# EAGLE schematic schematic (EAGLE 9.5.0)

## Sheet 1 of 8: GPS
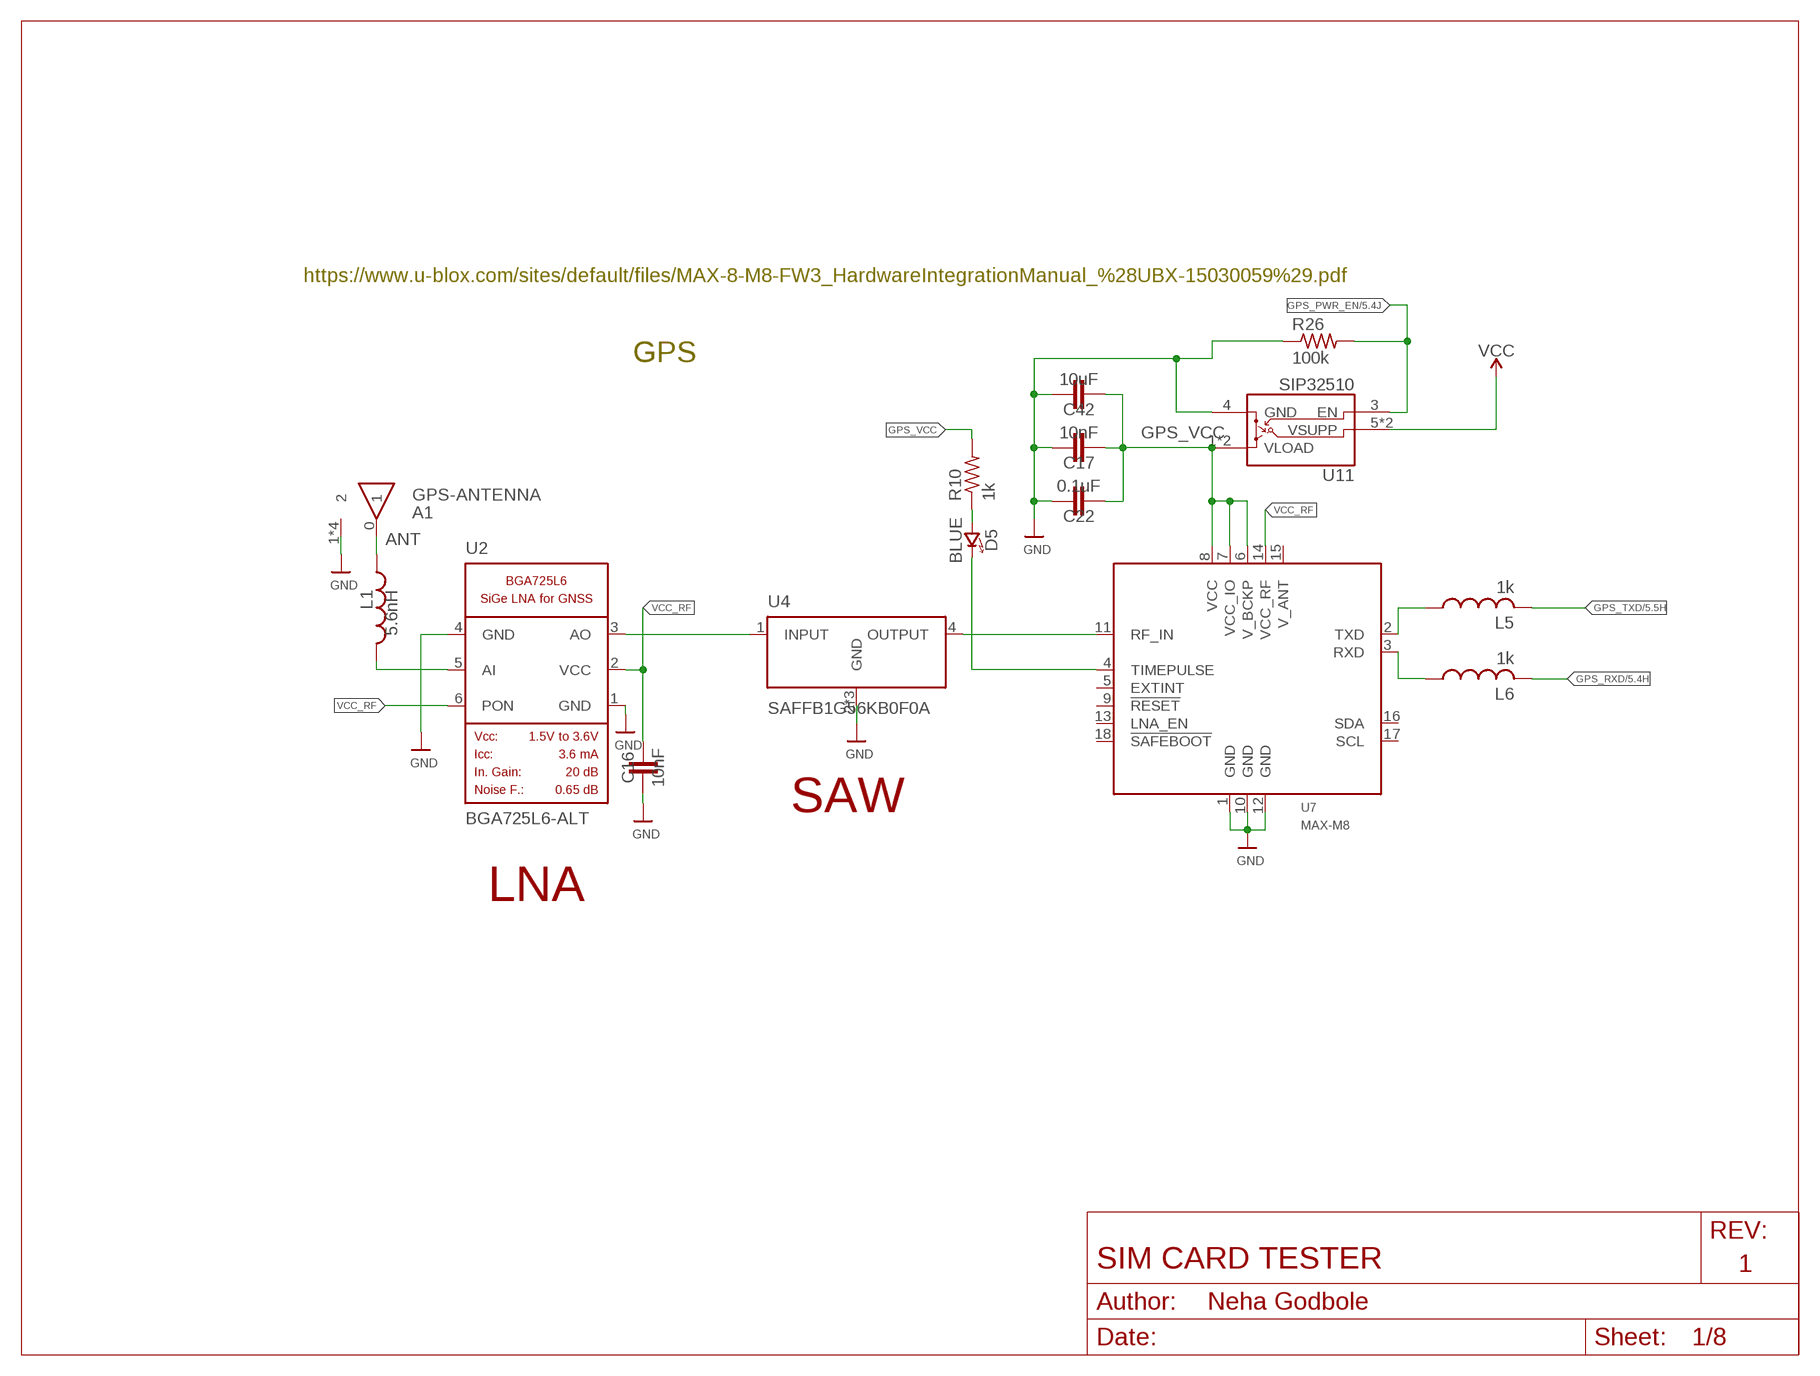
[diagram p0: schematic, sheet 1]
FRAME7 (LETTER_L_BLANK): AUTHOR: Neha Godbole; REV: 1; TITLE: SIM CARD TESTER

### Parts
A1  GPS-ANTENNA  [ANT1818B00BT1516S]
C16  10nF  CAPACITOR_0603_L  [RESC0603_L]
C17  10nF  CAPACITOR_0603_L  [RESC0603_L]
C22  0.1uF  CAPACITOR_0603_L  [RESC0603_L]
C42  10uF  CAPACITOR_0603_L  [RESC0603_L]
D5  BLUE  LED0603  [LED-0603]
L1  5.6nH  INDUCTOR_0603_M  [RESC0603_M]
L5  1k  INDUCTOR_0603_M  [RESC0603_M]
L6  1k  INDUCTOR_0603_M  [RESC0603_M]
R10  1k  R-US_R0603  [R0603]
R26  100k  R-US_R0603  [R0603]
U2  BGA725L6-ALT  [LNA-TSLP-6-2-ALT]
U4  SAFFB1G56KB0F0A  FILTERS  [QCS5I]
U7  MAX-M8  [MAX-M8]
U11  SIP32510  [TSOT23-6]

### Nets
ANT: A1.0 L1.2
GND: A1.1 A1.2 A1.3 A1.4 C16.1 C17.1 C22.1 C42.1 R26.1 U2.1(GND) U2.4(GND) U4.2(GND) U4.3(GND) U4.5(GND) U7.1(GND) U7.10(GND) U7.12(GND) U11.4(GND) ; also sheet 2,3,4,5,6,7,8
GPS_PWR_EN: R26.2 U11.3(EN) ; also sheet 5,8
GPS_RF_IN: U4.4(OUTPUT) U7.11(RF_IN)
GPS_RXD: L6.2 ; also sheet 5,8
GPS_TXD: L5.2 ; also sheet 5,8
GPS_VCC: C17.2 C22.2 C42.2 R10.2 U7.6(V_BCKP) U7.7(VCC_IO) U7.8(VCC) U11.1(VLOAD) U11.2(VLOAD)
LNA_IN: L1.1 U2.5(AI)
LNA_OUT: U2.3(AO) U4.1(INPUT)
N$1: D5.A(ANODE) R10.1
N$2: D5.C(CATHODE) U7.4(TIMEPULSE)
N$7: L5.1 U7.2(TXD)
N$8: L6.1 U7.3(RXD)
VCC: U11.5(VSUPP) U11.6(VSUPP) ; also sheet 2,3,4,5,6,7,8
VCC_RF: C16.2 U2.2(VCC) U2.6(PON) U7.14(VCC_RF)
Unconnected: U7.5(EXTINT) U7.9(!RESET) U7.13(LNA_EN) U7.15(V_ANT) U7.16(SDA) U7.17(SCL) U7.18(!SAFEBOOT)

### Notes on the sheet
- https://www.u-blox.com/sites/default/files/MAX-8-M8-FW3_HardwareIntegrationManual_%28UBX-15030059%29.pdf
- GPS
- SAW
- LNA

## Sheet 2 of 8: Hardware Watchdog & RTC
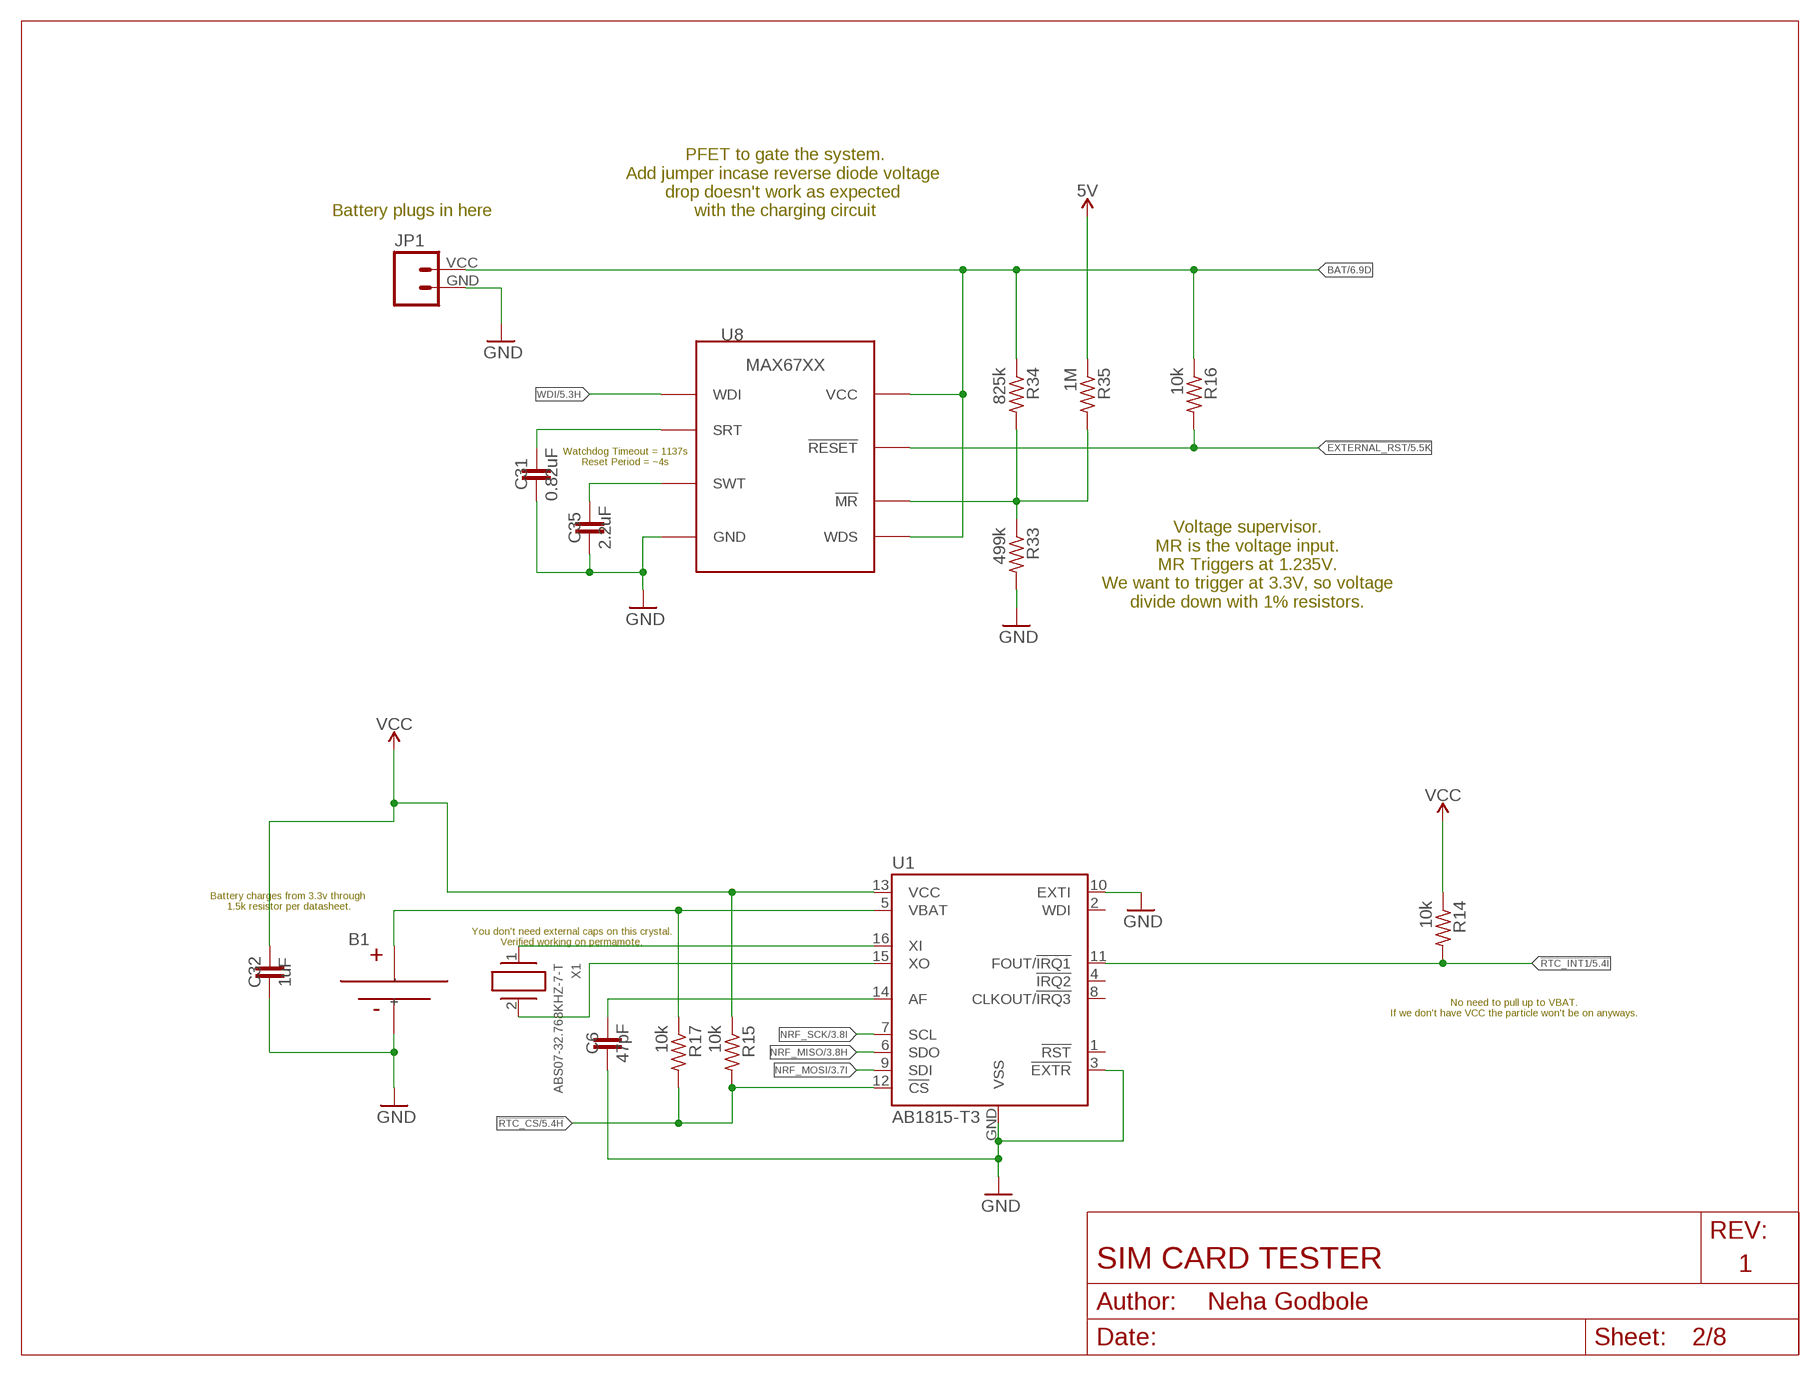
[diagram p1: schematic, sheet 2]
FRAME6 (LETTER_L_BLANK): AUTHOR: Neha Godbole; REV: 1; TITLE: SIM CARD TESTER

### Parts
B1  MS518SE  [MS518SE-FL35E]
C6  47pF  CAPACITOR_0603_L  [RESC0603_L]
C31  0.82uF  CAPACITOR_0603_L  [RESC0603_L]
C32  1uF  CAPACITOR_0603_L  [RESC0603_L]
C35  2.2uF  CAPACITOR_0603_L  [RESC0603_L]
JP1  M024UCON-15767  [JST-2-SMD-VERT]
R14  10k  R-US_R0603  [R0603]
R15  10k  R-US_R0603  [R0603]
R16  10k  R-US_R0603  [R0603]
R17  10k  R-US_R0603  [R0603]
R33  499k  R-US_R0603  [R0603]
R34  825k  R-US_R0603  [R0603]
R35  1M  R-US_R0603  [R0603]
U1  AB1815-T3  [QFN-16-3MM]
U8  MAX67XXMAX6749MAX67XX  [SOT-23-8]
X1  ABS07-32.768KHZ-7-T  [2-SMD]

### Nets
5V: R35.1 ; also sheet 4,6,8
!EXTERNAL_RST: R16.2 U8.7(!RESET) ; also sheet 5,8
!RTC_CS: R15.2 R17.2 U1.12(!CS) ; also sheet 5,8
!RTC_INT1: R14.2 U1.11(FOUT/!IRQ1) ; also sheet 5,8
BAT: JP1.VCC R16.1 R34.1 U8.5(WDS) U8.8(VCC) ; also sheet 6
GND: B1.- C6.2 C31.2 C32.2 C35.2 JP1.GND R33.2 U1.3(!EXTR) U1.10(EXTI) U1.GND(VSS) U8.4(GND) ; also sheet 1,3,4,5,6,7,8
N$5: B1.+ R17.1 U1.5(VBAT)
N$13: C6.1 U1.14(AF)
N$20: U1.15(XO) X1.2
N$21: U1.16(XI) X1.1
N$31: R33.1 R34.2 R35.2 U8.1(!MR)
N$36: C31.1 U8.3(SRT)
N$39: C35.1 U8.2(SWT)
NRF_MISO: U1.6(SDO) ; also sheet 3,5,8
NRF_MOSI: U1.9(SDI) ; also sheet 3,5,8
NRF_SCK: U1.7(SCL) ; also sheet 3
VCC: C32.1 R14.1 R15.1 U1.13(VCC) ; also sheet 1,3,4,5,6,7,8
WDI: U8.6(WDI) ; also sheet 5,8
Unconnected: U1.1(!RST) U1.2(WDI) U1.4(!IRQ2) U1.8(CLKOUT/!IRQ3)

### Notes on the sheet
- Battery plugs in here
- PFET to gate the system.
  Add jumper incase reverse diode voltage 
  drop doesn't work as expected 
  with the charging circuit
- Watchdog Timeout = 1137s
  Reset Period = ~4s
- Voltage supervisor.
  MR is the voltage input.
  MR Triggers at 1.235V.
  We want to trigger at 3.3V, so voltage
  divide down with 1% resistors.
- Battery charges from 3.3v through
   1.5k resistor per datasheet.
- You don't need external caps on this crystal.
  Verified working on permamote.
- No need to pull up to VBAT.
  If we don't have VCC the particle won't be on anyways.

## Sheet 3 of 8: SD Card Adapter
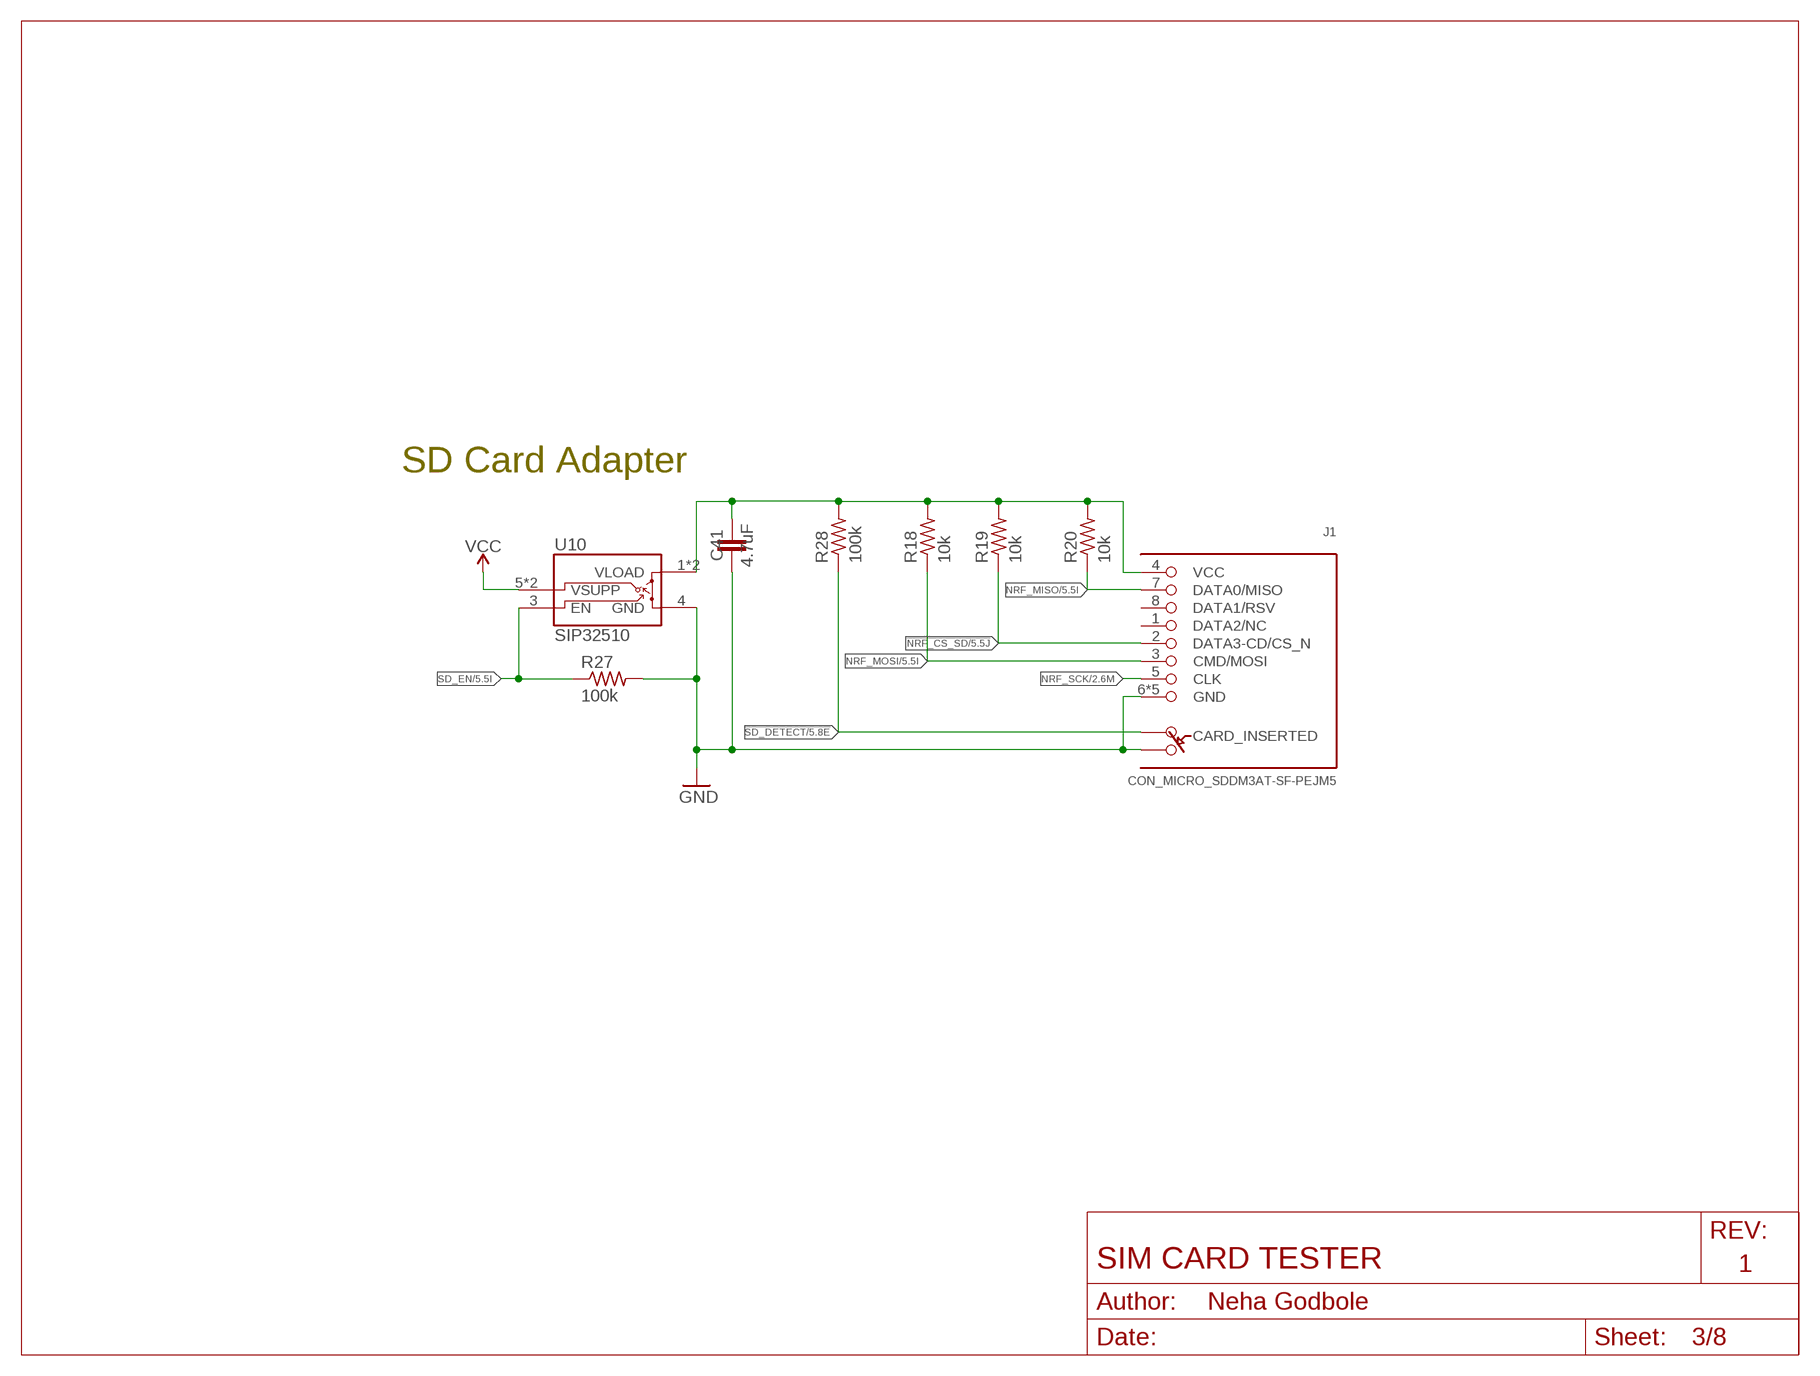
[diagram p2: schematic, sheet 3]
FRAME5 (LETTER_L_BLANK): AUTHOR: Neha Godbole; REV: 1; TITLE: SIM CARD TESTER

### Parts
C41  4.7uF  CAPACITOR_0603_L  [RESC0603_L]
J1  CON_MICRO_SDDM3AT-SF-PEJM5  [DM3AT-SF-PEJM5]
R18  10k  R-US_R0603  [R0603]
R19  10k  R-US_R0603  [R0603]
R20  10k  R-US_R0603  [R0603]
R27  100k  R-US_R0603  [R0603]
R28  100k  R-US_R0603  [R0603]
U10  SIP32510  [TSOT23-6]

### Nets
!NRF_CS_SD: J1.2(DATA3-CD/CS_N) R19.1 ; also sheet 5,8
!SD_DETECT: J1.A R28.1 ; also sheet 5,8
GND: C41.2 J1.6(GND) J1.B J1.MOUNT0(GND) J1.MOUNT1(GND) J1.MOUNT2(GND) J1.MOUNT3(GND) R27.2 U10.4(GND) ; also sheet 1,2,4,5,6,7,8
N$55: C41.1 J1.4(VCC) R18.2 R19.2 R20.2 R28.2 U10.1(VLOAD) U10.2(VLOAD)
NRF_MISO: J1.7(DATA0/MISO) R20.1 ; also sheet 2,5,8
NRF_MOSI: J1.3(CMD/MOSI) R18.1 ; also sheet 2,5,8
NRF_SCK: J1.5(CLK) ; also sheet 2
SD_EN: R27.1 U10.3(EN) ; also sheet 5,8
VCC: U10.5(VSUPP) U10.6(VSUPP) ; also sheet 1,2,4,5,6,7,8
Unconnected: J1.1(DATA2/NC) J1.8(DATA1/RSV)

### Notes on the sheet
- SD Card Adapter

## Sheet 4 of 8: USB
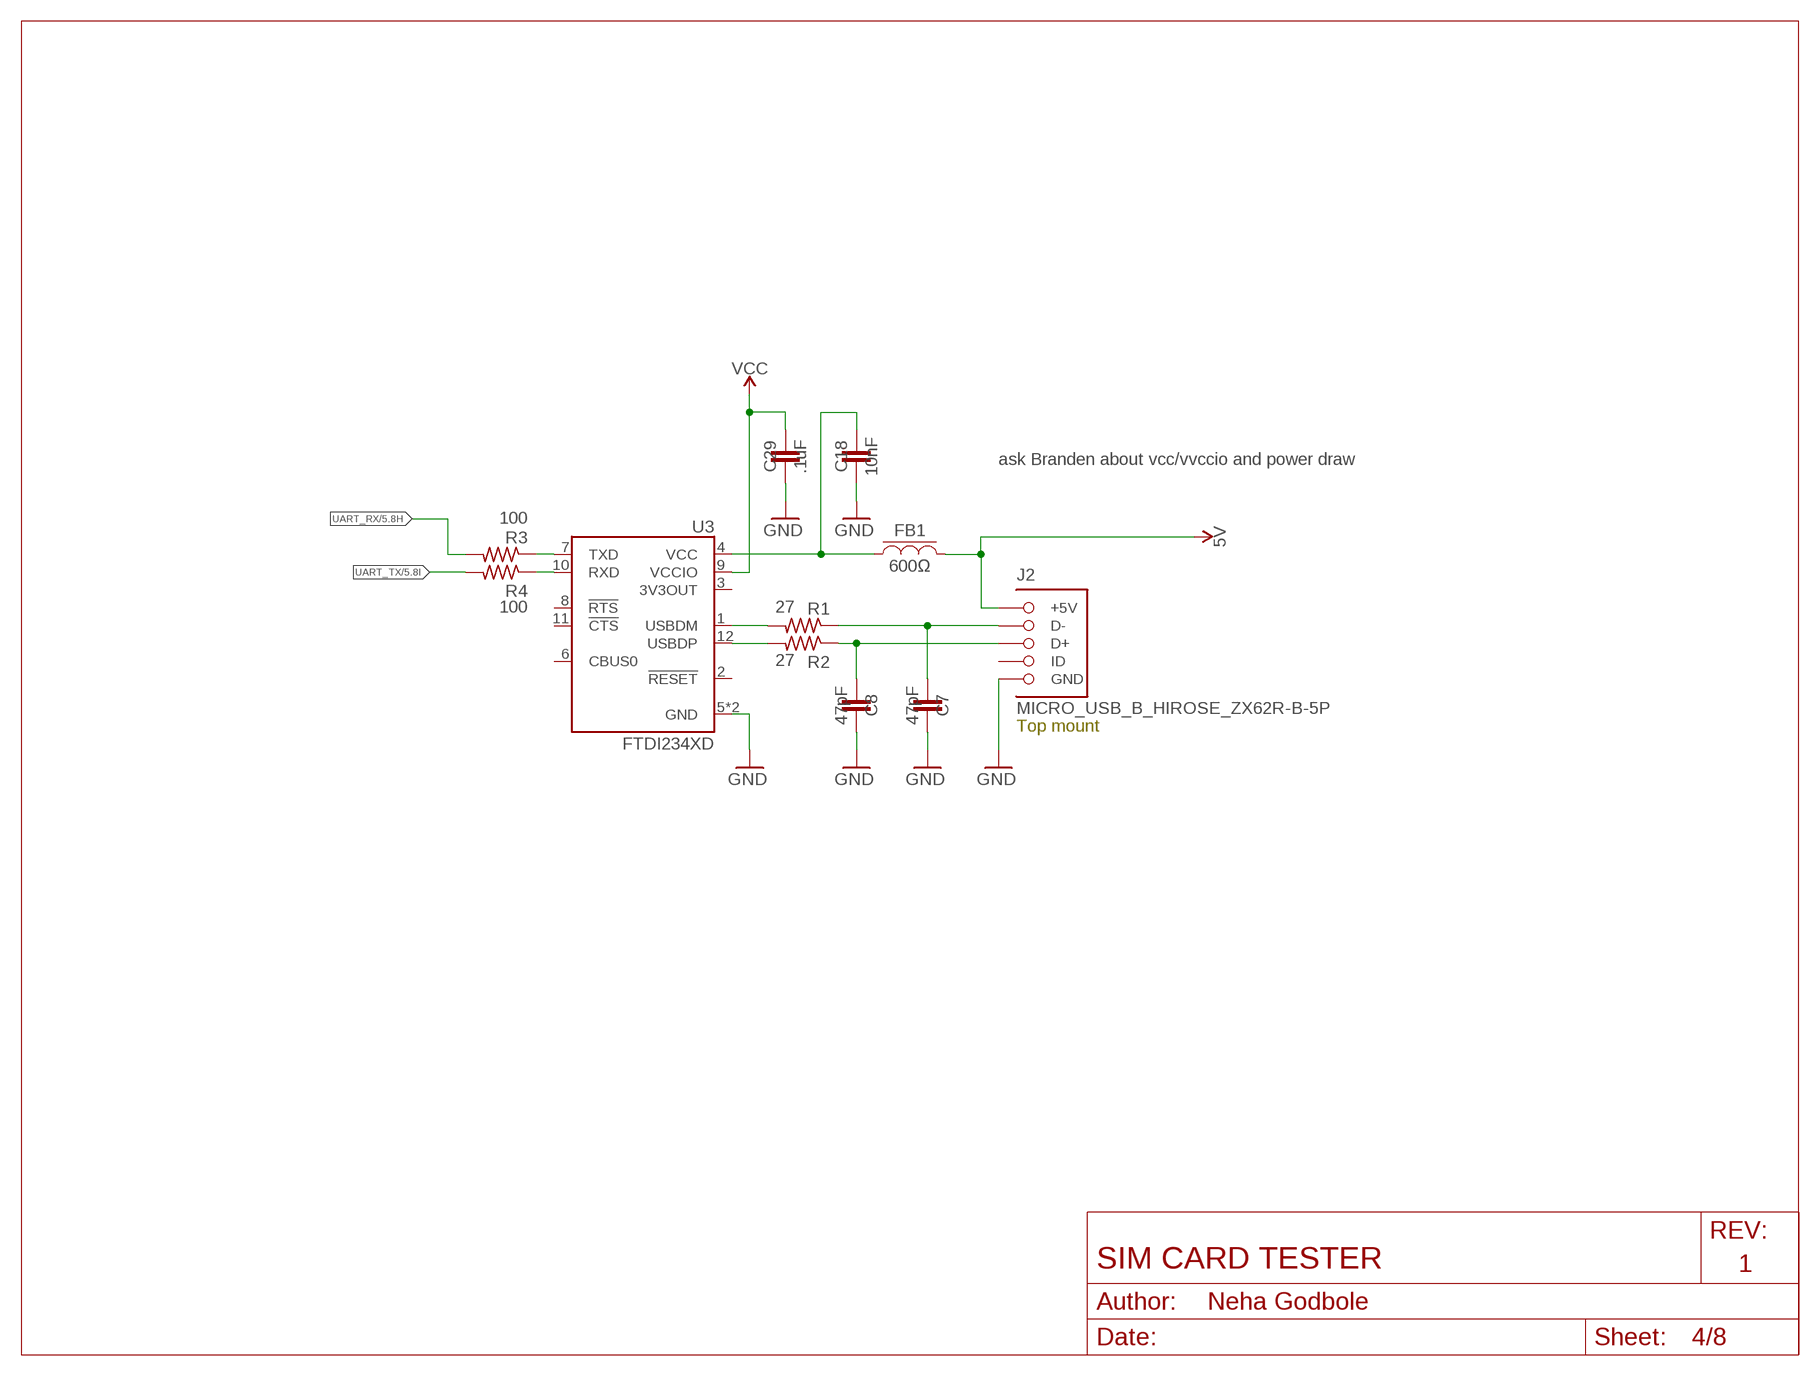
[diagram p3: schematic, sheet 4]
FRAME4 (LETTER_L_BLANK): AUTHOR: Neha Godbole; REV: 1; TITLE: SIM CARD TESTER

### Parts
C7  47pF  CAPACITOR_0603_L  [RESC0603_L]
C8  47pF  CAPACITOR_0603_L  [RESC0603_L]
C18  10nF  CAPACITOR_0603_L  [RESC0603_L]
C29  .1uF  CAPACITOR_0603_L  [RESC0603_L]
FB1  600Ω  FERRITE_BEAD0805  [0805_CAP]
J2  MICRO_USB_B_HIROSE_ZX62R-B-5P  [USB_MICRO_B-HIROSE-ZX62R-B-5P]
R1  27  R-US_R0603  [R0603]
R2  27  R-US_R0603  [R0603]
R3  100  R-US_R0603  [R0603]
R4  100  R-US_R0603  [R0603]
U3  FTDI234XD  [DFN-12/3MM]

### Nets
5V: FB1.P$2 J2.1(+5V) ; also sheet 2,6,8
D+: C8.1 J2.3(D+) R2.1
D-: C7.1 J2.2(D-) R1.1
GND: C7.2 C8.2 C18.2 C29.2 J2.5(GND) U3.5(GND) U3.13(GND) ; also sheet 1,2,3,5,6,7,8
N$3: R1.2 U3.1(USBDM)
N$4: R2.2 U3.12(USBDP)
N$6: R4.1 U3.10(RXD)
N$24: R3.1 U3.7(TXD)
N$28: C18.1 FB1.P$1 U3.4(VCC)
UART_RX: R3.2 ; also sheet 5,8
UART_TX: R4.2 ; also sheet 5,8
VCC: C29.1 U3.9(VCCIO) ; also sheet 1,2,3,5,6,7,8
Unconnected: J2.4(ID) U3.2(!RESET) U3.3(3V3OUT) U3.6(CBUS0) U3.8(!RTS) U3.11(!CTS)

### Notes on the sheet
- ask Branden about vcc/vvccio and power draw
- Top mount

## Sheet 5 of 8: NRF
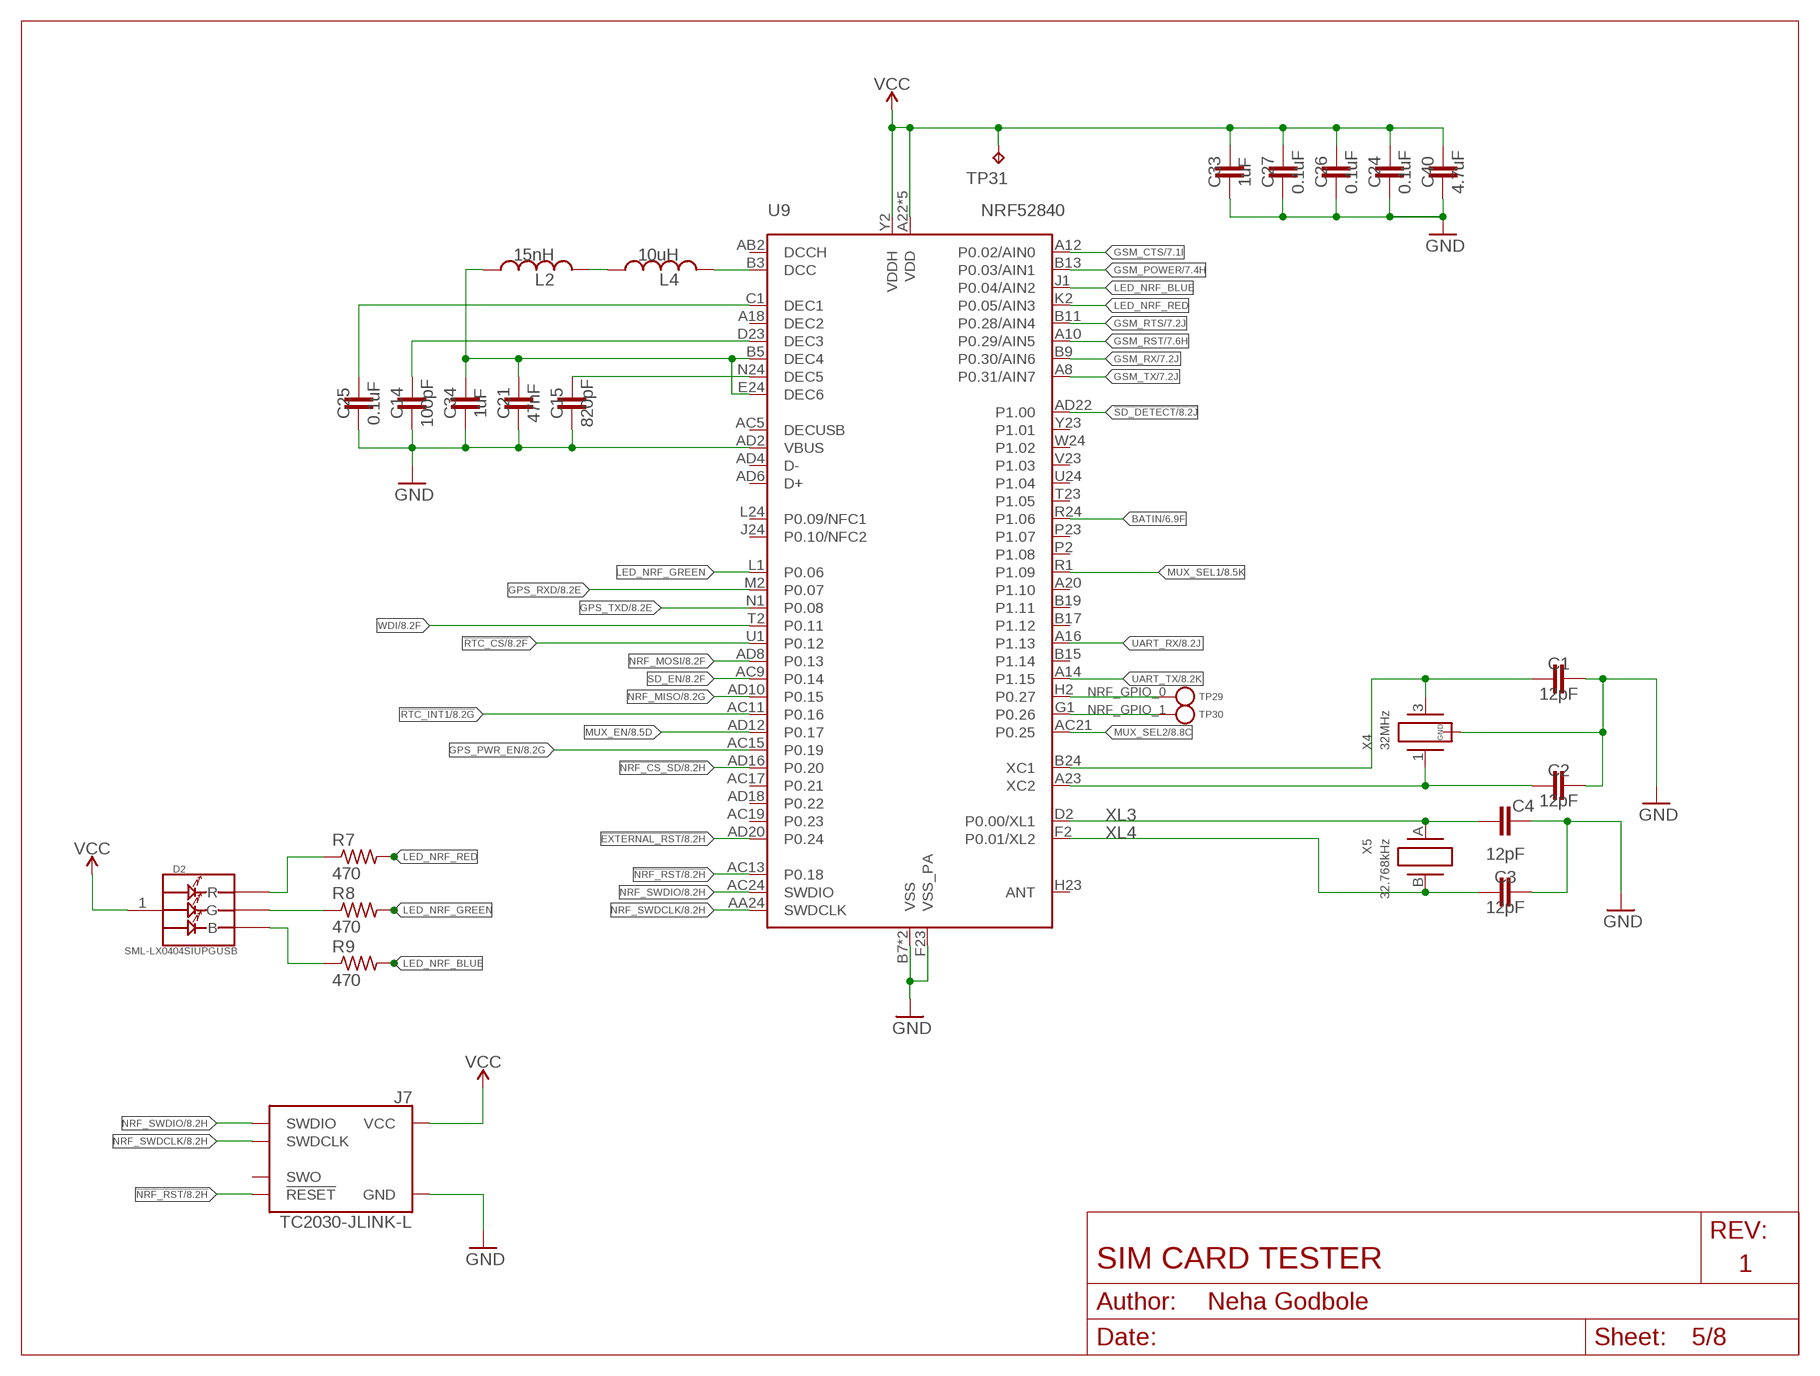
[diagram p4: schematic, sheet 5]
FRAME3 (LETTER_L_BLANK): AUTHOR: Neha Godbole; REV: 1; TITLE: SIM CARD TESTER

### Parts
C1  12pF  CAPACITOR_0603_L  [RESC0603_L]
C2  12pF  CAPACITOR_0603_L  [RESC0603_L]
C3  12pF  CAPACITOR_0603_L  [RESC0603_L]
C4  12pF  CAPACITOR_0603_L  [RESC0603_L]
C14  100pF  CAPACITOR_0603_L  [RESC0603_L]
C15  820pF  CAPACITOR_0603_L  [RESC0603_L]
C21  47nF  CAPACITOR_0603_L  [RESC0603_L]
C24  0.1uF  CAPACITOR_0603_L  [RESC0603_L]
C25  0.1uF  CAPACITOR_0603_L  [RESC0603_L]
C26  0.1uF  CAPACITOR_0603_L  [RESC0603_L]
C27  0.1uF  CAPACITOR_0603_L  [RESC0603_L]
C33  1uF  CAPACITOR_0603_L  [RESC0603_L]
C34  1uF  CAPACITOR_0603_L  [RESC0603_L]
C40  4.7uF  CAPACITOR_0603_L  [RESC0603_L]
D2  SML-LX0404SIUPGUSB  [1MM_SQ_4PAD]
J7  TC2030-JLINK-L  [TC2030-IDC]
L2  15nH  INDUCTOR_0603_M  [RESC0603_M]
L4  10uH  INDUCTOR_0603_M  [RESC0603_M]
R7  470  R-US_R0603  [R0603]
R8  470  R-US_R0603  [R0603]
R9  470  R-US_R0603  [R0603]
TP29  TEST-POINT  [PAD.03X.03]
TP30  TEST-POINT  [PAD.03X.03]
TP31  TPTP06SQ  [TP06SQ]
U9  NRF52840  [AQFN73]
X4  32MHz  7V-32.000MAHV-T  [TXC-7V]
X5  32.768kHz  ABS05-32.768KHZ-9-T  [ABS05]

### Nets
!EXTERNAL_RST: U9.AD20(P0.24) ; also sheet 2,8
!NRF_CS_SD: U9.AD16(P0.20) ; also sheet 3,8
!NRF_RST: J7.3(!RESET) U9.AC13(P0.18) ; also sheet 8
!RTC_CS: U9.U1(P0.12) ; also sheet 2,8
!RTC_INT1: U9.AC11(P0.16) ; also sheet 2,8
!SD_DETECT: U9.AD22(P1.00) ; also sheet 3,8
BATIN: U9.R24(P1.06) ; also sheet 6,8
GND: C1.1 C2.1 C3.1 C4.1 C14.2 C15.2 C21.2 C24.2 C25.2 C26.2 C27.2 C33.2 C34.2 C40.2 J7.5(GND) U9.AD2(VBUS) U9.B7(VSS) U9.F23(VSS_PA) U9.GND(VSS) X4.2(GND) X4.4(GND) ; also sheet 1,2,3,4,6,7,8
GPS_PWR_EN: U9.AC15(P0.19) ; also sheet 1,8
GPS_RXD: U9.M2(P0.07) ; also sheet 1,8
GPS_TXD: U9.N1(P0.08) ; also sheet 1,8
GSM_CTS: U9.A12(P0.02/AIN0) ; also sheet 7,8
GSM_POWER: U9.B13(P0.03/AIN1) ; also sheet 7,8
GSM_RST: U9.A10(P0.29/AIN5) ; also sheet 7,8
GSM_RTS: U9.B11(P0.28/AIN4) ; also sheet 7,8
GSM_RX: U9.B9(P0.30/AIN6) ; also sheet 7
GSM_TX: U9.A8(P0.31/AIN7) ; also sheet 7,8
LED_NRF_BLUE: R9.2 U9.J1(P0.04/AIN2)
LED_NRF_GREEN: R8.2 U9.L1(P0.06)
LED_NRF_RED: R7.2 U9.K2(P0.05/AIN3)
MUX_EN: U9.AD12(P0.17) ; also sheet 8
MUX_SEL1: U9.R1(P1.09) ; also sheet 8
MUX_SEL2: U9.AC21(P0.25) ; also sheet 8
N$27: C25.1 U9.C1(DEC1)
N$32: C21.1 C34.1 L2.1 U9.B5(DEC4) U9.E24(DEC6)
N$34: C14.1 U9.D23(DEC3)
N$43: C1.2 U9.B24(XC1) X4.3
N$45: C2.2 U9.A23(XC2) X4.1
N$46: L4.2 U9.B3(DCC)
N$47: L2.2 L4.1
N$48: C15.1 U9.N24(DEC5)
N$59: D2.2(R) R7.1
N$60: D2.4(G) R8.1
N$61: D2.3(B) R9.1
NRF_GPIO_0: TP29.P$1(TESTPOINT) U9.H2(P0.27)
NRF_GPIO_1: TP30.P$1(TESTPOINT) U9.G1(P0.26)
NRF_MISO: U9.AD10(P0.15) ; also sheet 2,3,8
NRF_MOSI: U9.AD8(P0.13) ; also sheet 2,3,8
NRF_SWDCLK: J7.4(SWDCLK) U9.AA24(SWDCLK) ; also sheet 8
NRF_SWDIO: J7.2(SWDIO) U9.AC24(SWDIO) ; also sheet 8
SD_EN: U9.AC9(P0.14) ; also sheet 3,8
UART_RX: U9.A16(P1.13) ; also sheet 4,8
UART_TX: U9.A14(P1.15) ; also sheet 4,8
VCC: C24.1 C26.1 C27.1 C33.1 C40.1 D2.1(VDD) J7.1(VCC) TP31.TP U9.A22(VDD) U9.AD14(VDD) U9.AD23(VDD) U9.B1(VDD) U9.W1(VDD) U9.Y2(VDDH) ; also sheet 1,2,3,4,6,7,8
WDI: U9.T2(P0.11) ; also sheet 2,8
XL3: C4.2 U9.D2(P0.00/XL1) X5.A
XL4: C3.2 U9.F2(P0.01/XL2) X5.B
Unconnected: J7.6(SWO) U9.A18(DEC2) U9.A20(P1.10) U9.AB2(DCCH) U9.AC5(DECUSB) U9.AC17(P0.21) U9.AC19(P0.23) U9.AD4(D-) U9.AD6(D+) U9.AD18(P0.22) U9.B15(P1.14) U9.B17(P1.12) U9.B19(P1.11) U9.H23(ANT) U9.J24(P0.10/NFC2) U9.L24(P0.09/NFC1) U9.P2(P1.08) U9.P23(P1.07) U9.T23(P1.05) U9.U24(P1.04) U9.V23(P1.03) U9.W24(P1.02) U9.Y23(P1.01)

## Sheet 6 of 8: Power Suppy and Charging
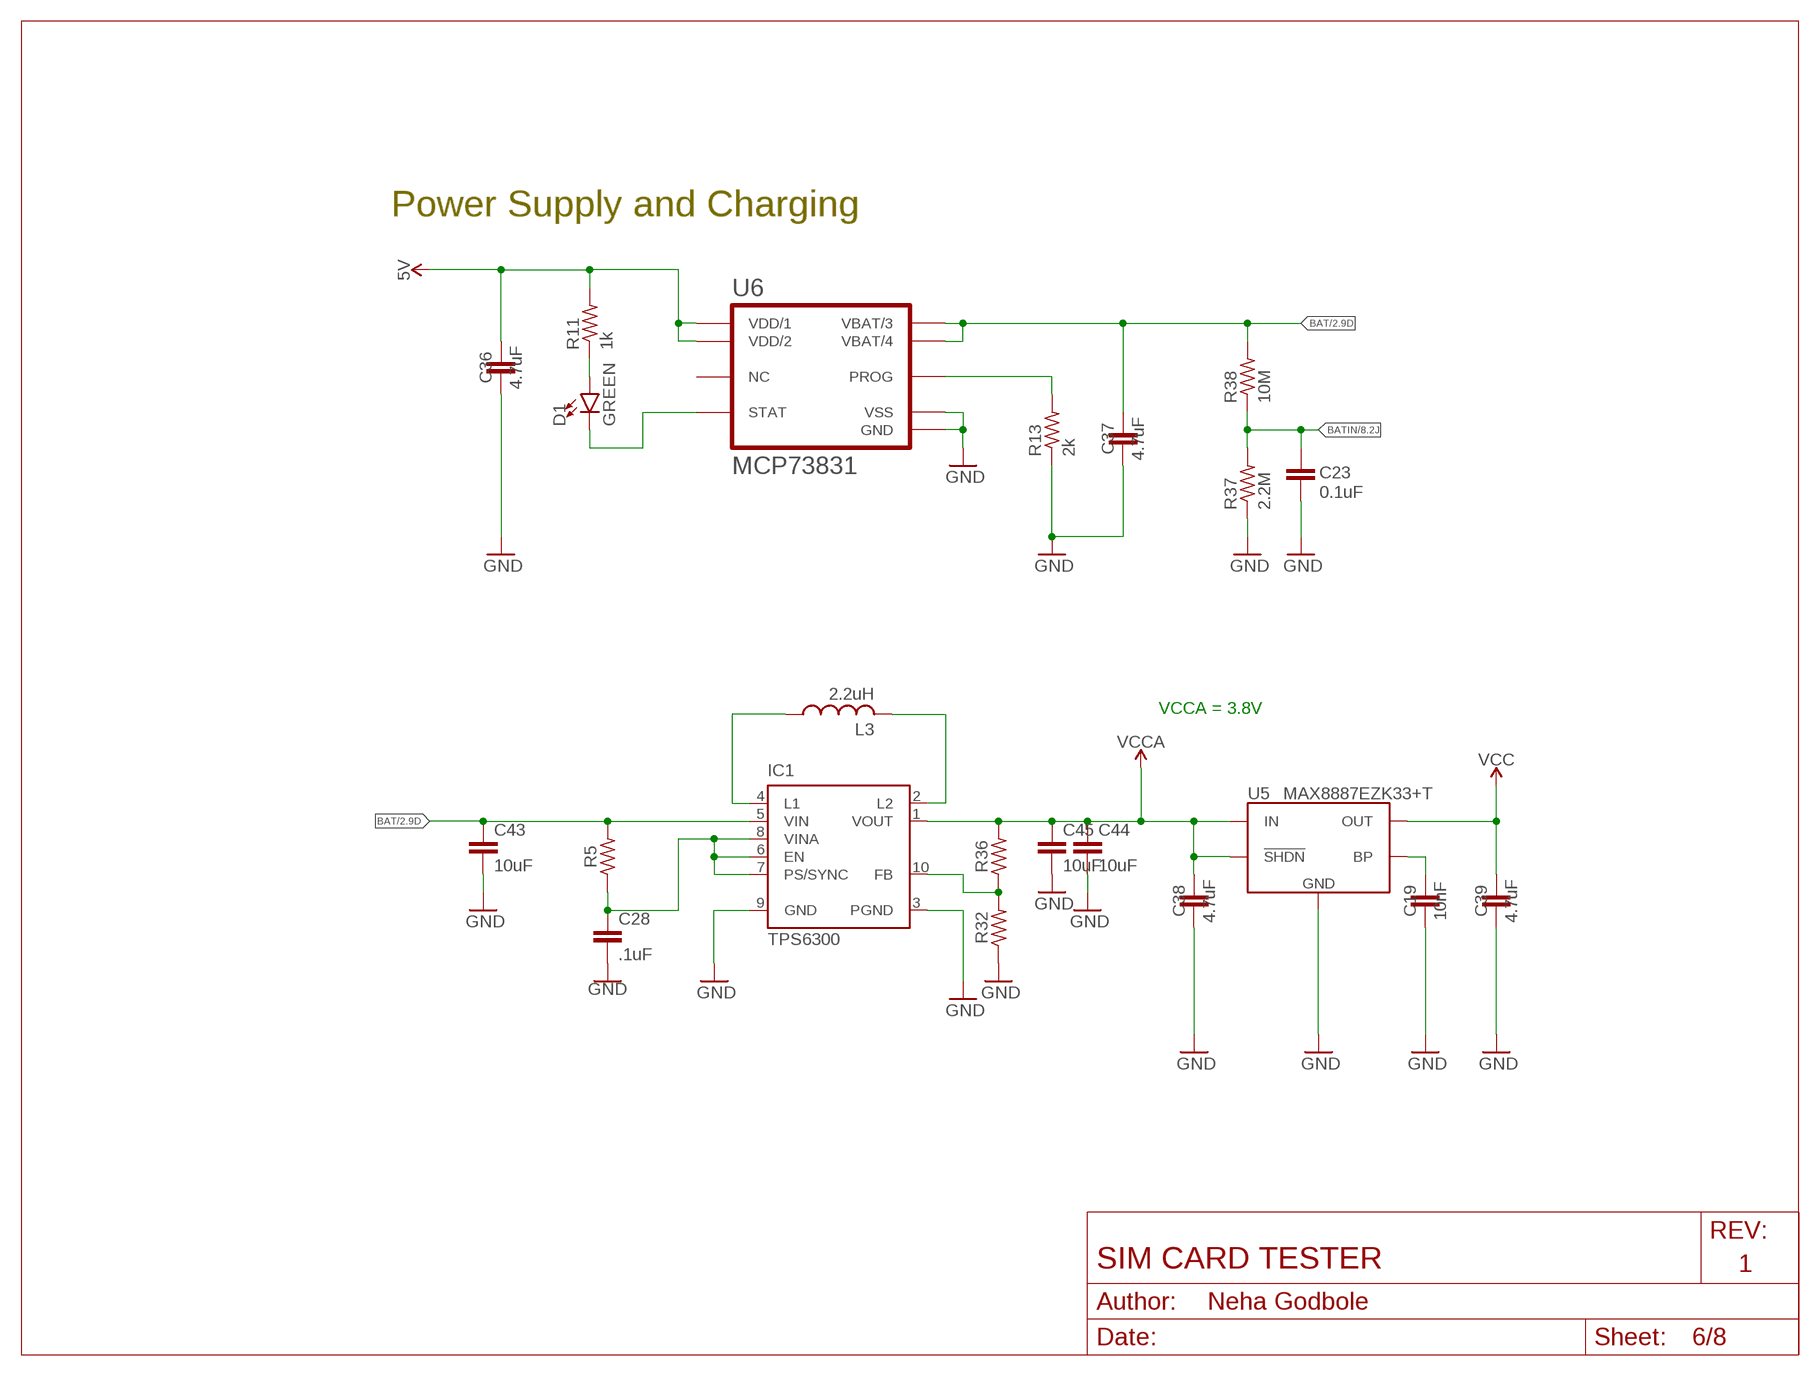
[diagram p5: schematic, sheet 6]
FRAME2 (LETTER_L_BLANK): AUTHOR: Neha Godbole; REV: 1; TITLE: SIM CARD TESTER

### Parts
C19  10nF  CAPACITOR_0603_L  [RESC0603_L]
C23  0.1uF  CAPACITOR_0603_L  [RESC0603_L]
C28  .1uF  CAPACITOR_0603_L  [RESC0603_L]
C36  4.7uF  CAPACITOR_0603_L  [RESC0603_L]
C37  4.7uF  CAPACITOR_0603_L  [RESC0603_L]
C38  4.7uF  CAPACITOR_0603_L  [RESC0603_L]
C39  4.7uF  CAPACITOR_0603_L  [RESC0603_L]
C43  10uF  CAPACITOR_0603_L  [RESC0603_L]
C44  10uF  CAPACITOR_0603_L  [RESC0603_L]
C45  10uF  CAPACITOR_0603_L  [RESC0603_L]
D1  GREEN  LED0603  [LED-0603]
IC1  TPS6300  [DRC-S-PVSON-N10]
L3  2.2uH  INDUCTOR_0603_M  [RESC0603_M]
R5  100  R-US_R0603  [R0603]
R11  1k  R-US_R0603  [R0603]
R13  2k  R-US_R0603  [R0603]
R32  200k  R-US_R0603  [R0603]
R36  1.3M  R-US_R0603  [R0603]
R37  2.2M  R-US_R0603  [R0603]
R38  10M  R-US_R0603  [R0603]
U5  MAX8887EZK33+T  [SOT-23-5]
U6  MCP73831  [DFN-8-MCP]

### Nets
5V: C36.1 R11.2 U6.1(VDD/1) U6.2(VDD/2) ; also sheet 2,4,8
!CHRG: D1.A R11.1
BAT: C37.1 C43.1 IC1.5(VIN) R5.2 R38.2 U6.3(VBAT/3) U6.4(VBAT/4) ; also sheet 2
BATIN: C23.2 R37.2 R38.1 ; also sheet 5,8
GND: C19.2 C23.1 C28.2 C36.2 C37.2 C38.2 C39.2 C43.2 C44.2 C45.2 IC1.3(PGND) IC1.9(GND) R13.1 R32.1 R37.1 U5.2(GND) U6.6(VSS) U6.GND ; also sheet 1,2,3,4,5,7,8
N$17: R13.2 U6.8(PROG)
N$19: D1.C U6.5(STAT)
N$22: IC1.4(L1) L3.1
N$26: IC1.2(L2) L3.2
N$29: C28.1 IC1.6(EN) IC1.7(PS/SYNC) IC1.8(VINA) R5.1
N$33: IC1.10(FB) R32.2 R36.1
N$35: C19.1 U5.4(BP)
VCC: C39.1 U5.5(OUT) ; also sheet 1,2,3,4,5,7,8
VCCA: C38.1 C44.1 C45.1 IC1.1(VOUT) R36.2 U5.1(IN) U5.3(!SHDN) ; also sheet 7
Unconnected: IC1.TH U6.7(NC)

### Notes on the sheet
- Power Supply and Charging
- VCCA = 3.8V

## Sheet 7 of 8: Sara U201
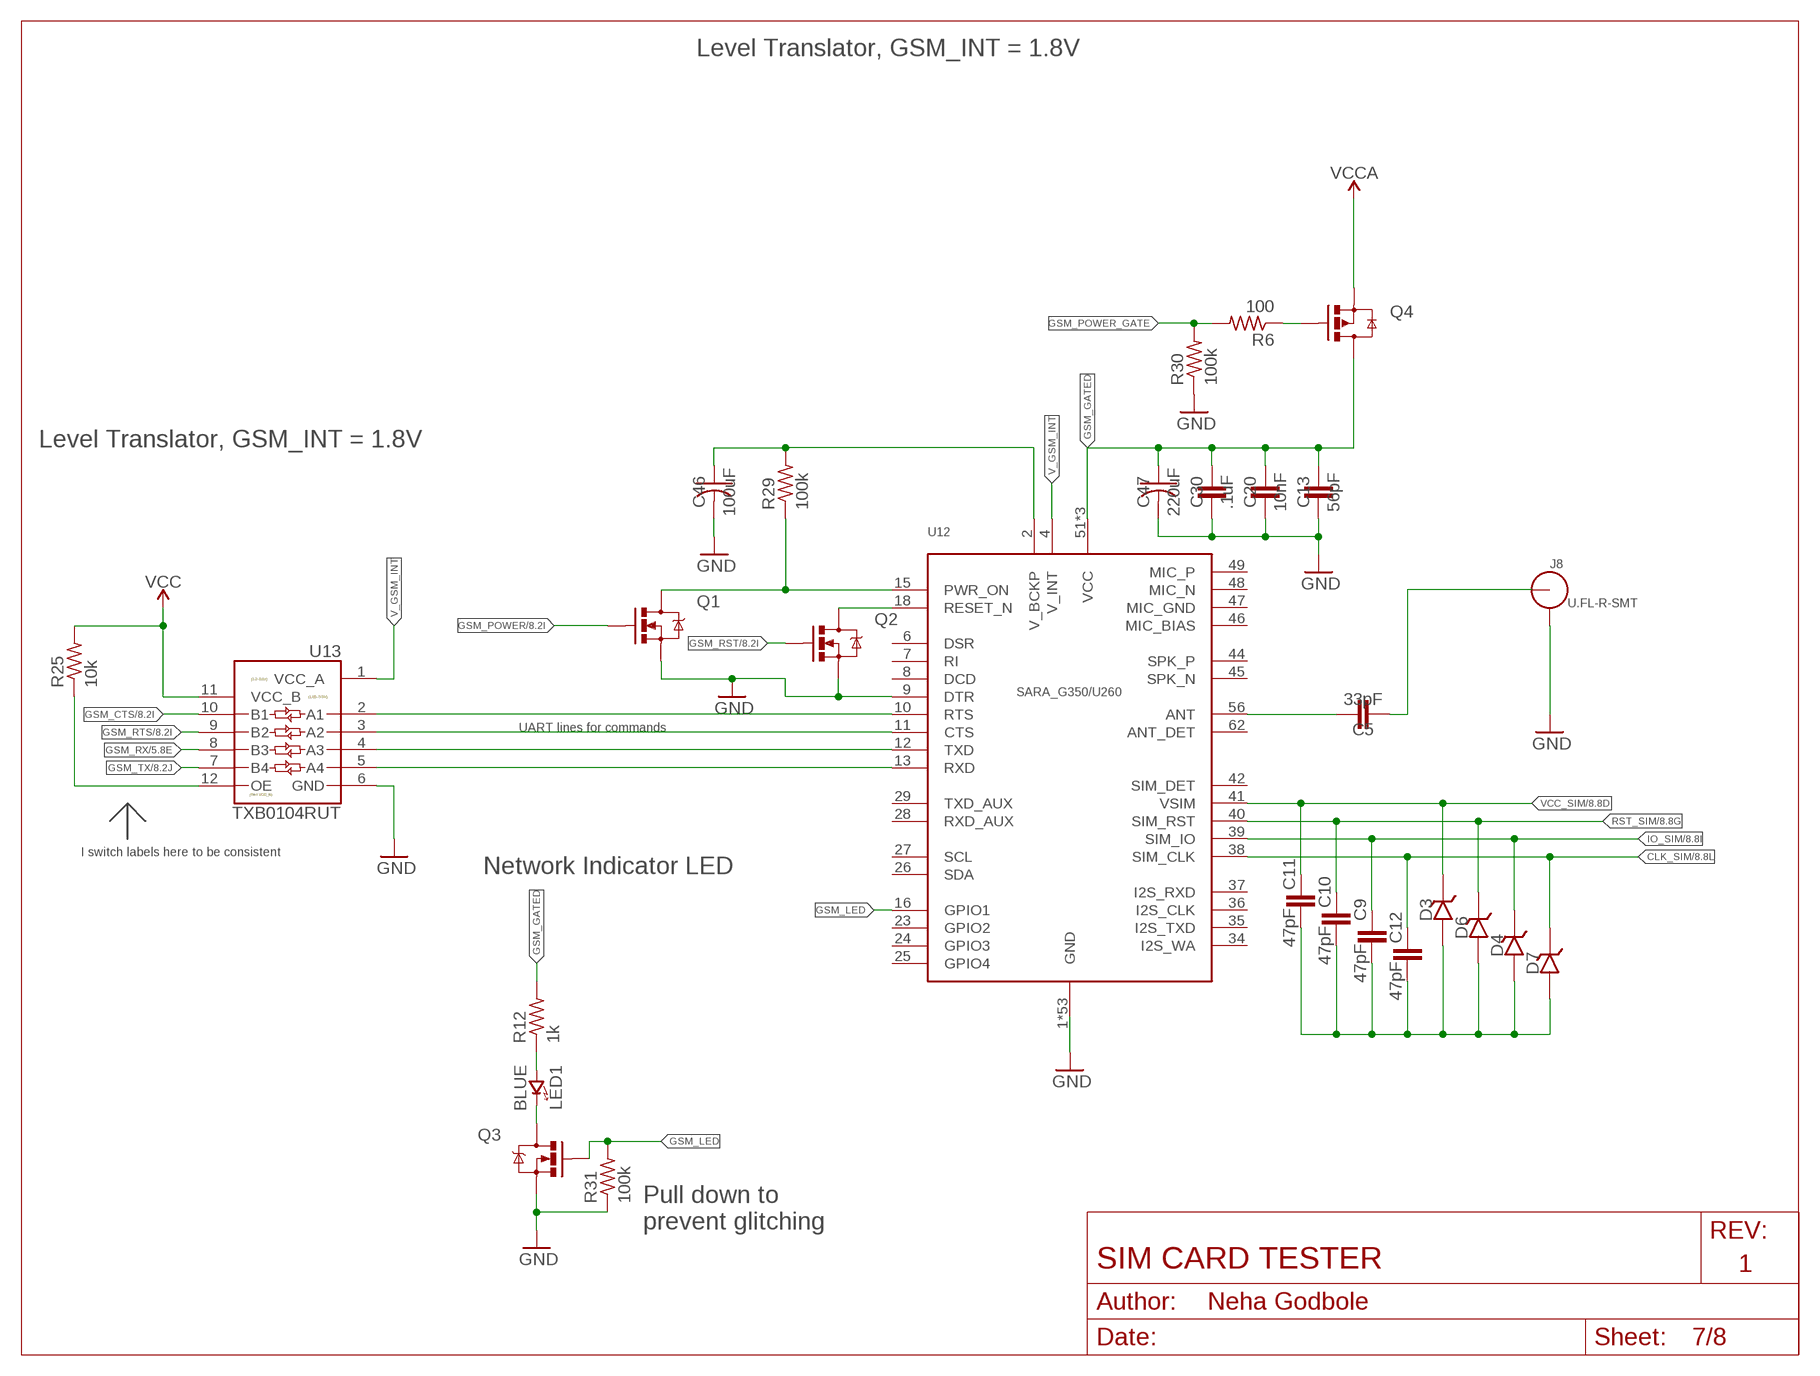
[diagram p6: schematic, sheet 7]
FRAME1 (LETTER_L_BLANK): AUTHOR: Neha Godbole; DATE: 4/22/19; REV: 1; TITLE: SIM CARD TESTER

### Parts
C5  33pF  CAPACITOR_0603_L  [RESC0603_L]
C9  47pF  CAPACITOR_0603_L  [RESC0603_L]
C10  47pF  CAPACITOR_0603_L  [RESC0603_L]
C11  47pF  CAPACITOR_0603_L  [RESC0603_L]
C12  47pF  CAPACITOR_0603_L  [RESC0603_L]
C13  56pF  CAPACITOR_0603_L  [RESC0603_L]
C20  10nF  CAPACITOR_0603_L  [RESC0603_L]
C30  .1uF  CAPACITOR_0603_L  [RESC0603_L]
C46  100uF  C-USC1210  [C1210]
C47  220uF  C-USC1210  [C1210]
D3  14V  DIODE_ZENER0402  [0402_DIODE]
D4  14V  DIODE_ZENER0402  [0402_DIODE]
D6  14V  DIODE_ZENER0402  [0402_DIODE]
D7  14V  DIODE_ZENER0402  [0402_DIODE]
J8  U.FL-R-SMT  [U.FL_SMT]
LED1  BLUE  LED0603  [LED-0603]
Q1  MOSFET-NCHANNELSMD  [SOT23-3]
Q2  MOSFET-NCHANNELSMD  [SOT23-3]
Q3  MOSFET-NCHANNELSMD  [SOT23-3]
Q4  SI223DDS  [SOT23-3]
R6  100  R-US_R0603  [R0603]
R12  1k  R-US_R0603  [R0603]
R25  10k  R-US_R0603  [R0603]
R29  100k  R-US_R0603  [R0603]
R30  100k  R-US_R0603  [R0603]
R31  100k  R-US_R0603  [R0603]
U12  UBLOX_SARA_G350  [UBLOX_SARA_G3]
U13  TXB0104RUT  [UQFN-12]

### Nets
CLK_SIM: C12.1 D7.CATHODE U12.38(SIM_CLK) ; also sheet 8
GND: C13.2 C20.2 C30.2 C46.2 C47.2 J8.GND1 J8.GND2 Q1.2(S) Q2.2(S) Q3.2(S) R30.1 R31.1 U12.1(GND) U12.3(GND) U12.5(GND) U12.9(DTR) U12.14(GND) U12.20(GND) U12.21(GND) U12.22(GND) U12.30(GND) U12.32(GND) U12.33(GND) U12.43(GND) U12.50(GND) U12.54(GND) U12.55(GND) U12.57(GND) U12.58(GND) U12.59(GND) U12.60(GND) U12.61(GND) U12.63(GND) U12.64(GND) U12.65(GND) U12.66(GND) U12.67(GND) U12.68(GND) U12.69(GND) U12.70(GND) U12.71(GND) U12.72(GND) U12.73(GND) U12.74(GND) U12.75(GND) U12.76(GND) U12.77(GND) U12.78(GND) U12.79(GND) U12.80(GND) U12.81(GND) U12.82(GND) U12.83(GND) U12.84(GND) U12.85(GND) U12.86(GND) U12.87(GND) U12.88(GND) U12.89(GND) U12.90(GND) U12.91(GND) U12.92(GND) U12.93(GND) U12.94(GND) U12.95(GND) U12.96(GND) U13.6(GND) ; also sheet 1,2,3,4,5,6,8
GSM_CTS: U13.10(B1) ; also sheet 5,8
GSM_GATED: C13.1 C20.1 C30.1 C47.1 Q4.3(D) R12.2 U12.51(VCC) U12.52(VCC) U12.53(VCC)
GSM_LED: Q3.1(G) R31.2 U12.16(GPIO1)
GSM_POWER: Q1.1(G) ; also sheet 5,8
GSM_POWER_GATE: R6.2 R30.2
GSM_RST: Q2.1(G) ; also sheet 5,8
GSM_RTS: U13.9(B2) ; also sheet 5,8
GSM_RX: U13.8(B3) ; also sheet 5
GSM_TX: U13.7(B4) ; also sheet 5,8
IO_SIM: C9.1 D4.CATHODE U12.39(SIM_IO) ; also sheet 8
N$9: U12.12(TXD) U13.4(A3)
N$12: U12.13(RXD) U13.5(A4)
N$14: LED1.C(CATHODE) Q3.3(D)
N$15: Q2.3(D) U12.18(RESET_N)
N$16: C46.1 R29.2 U12.2(V_BCKP)
N$18: Q1.3(D) R29.1 U12.15(PWR_ON)
N$23: LED1.A(ANODE) R12.1
N$25: U12.11(CTS) U13.3(A2)
N$53: U12.10(RTS) U13.2(A1)
N$66: Q4.1(G) R6.1
N$68: R25.1 U13.12(OE)
N$69: C5.1 U12.56(ANT)
N$70: C5.2 J8.SIG(ANT)
N$71: C9.2 C10.2 C11.2 C12.2 D3.ANODE D4.ANODE D6.ANODE D7.ANODE
RST_SIM: C10.1 D6.CATHODE U12.40(SIM_RST) ; also sheet 8
V_GSM_INT: U12.4(V_INT) U13.1(VCC_A)
VCC: R25.2 U13.11(VCC_B) ; also sheet 1,2,3,4,5,6,8
VCC_SIM: C11.1 D3.CATHODE U12.41(VSIM) ; also sheet 8
VCCA: Q4.2(S) ; also sheet 6
Unconnected: U12.6(DSR) U12.7(RI) U12.8(DCD) U12.23(GPIO2) U12.24(GPIO3) U12.25(GPIO4) U12.26(SDA) U12.27(SCL) U12.28(RXD_AUX) U12.29(TXD_AUX) U12.34(I2S_WA) U12.35(I2S_TXD) U12.36(I2S_CLK) U12.37(I2S_RXD) U12.42(SIM_DET) U12.44(SPK_P) U12.45(SPK_N) U12.46(MIC_BIAS) U12.47(MIC_GND) U12.48(MIC_N) U12.49(MIC_P) U12.62(ANT_DET)

### Notes on the sheet
- Level Translator, GSM_INT = 1.8V
- Level Translator, GSM_INT = 1.8V
- UART lines for commands
- I switch labels here to be consistent
- Network Indicator LED
- Pull down to
  prevent glitching

## Sheet 8 of 8: Sim Card Muxes
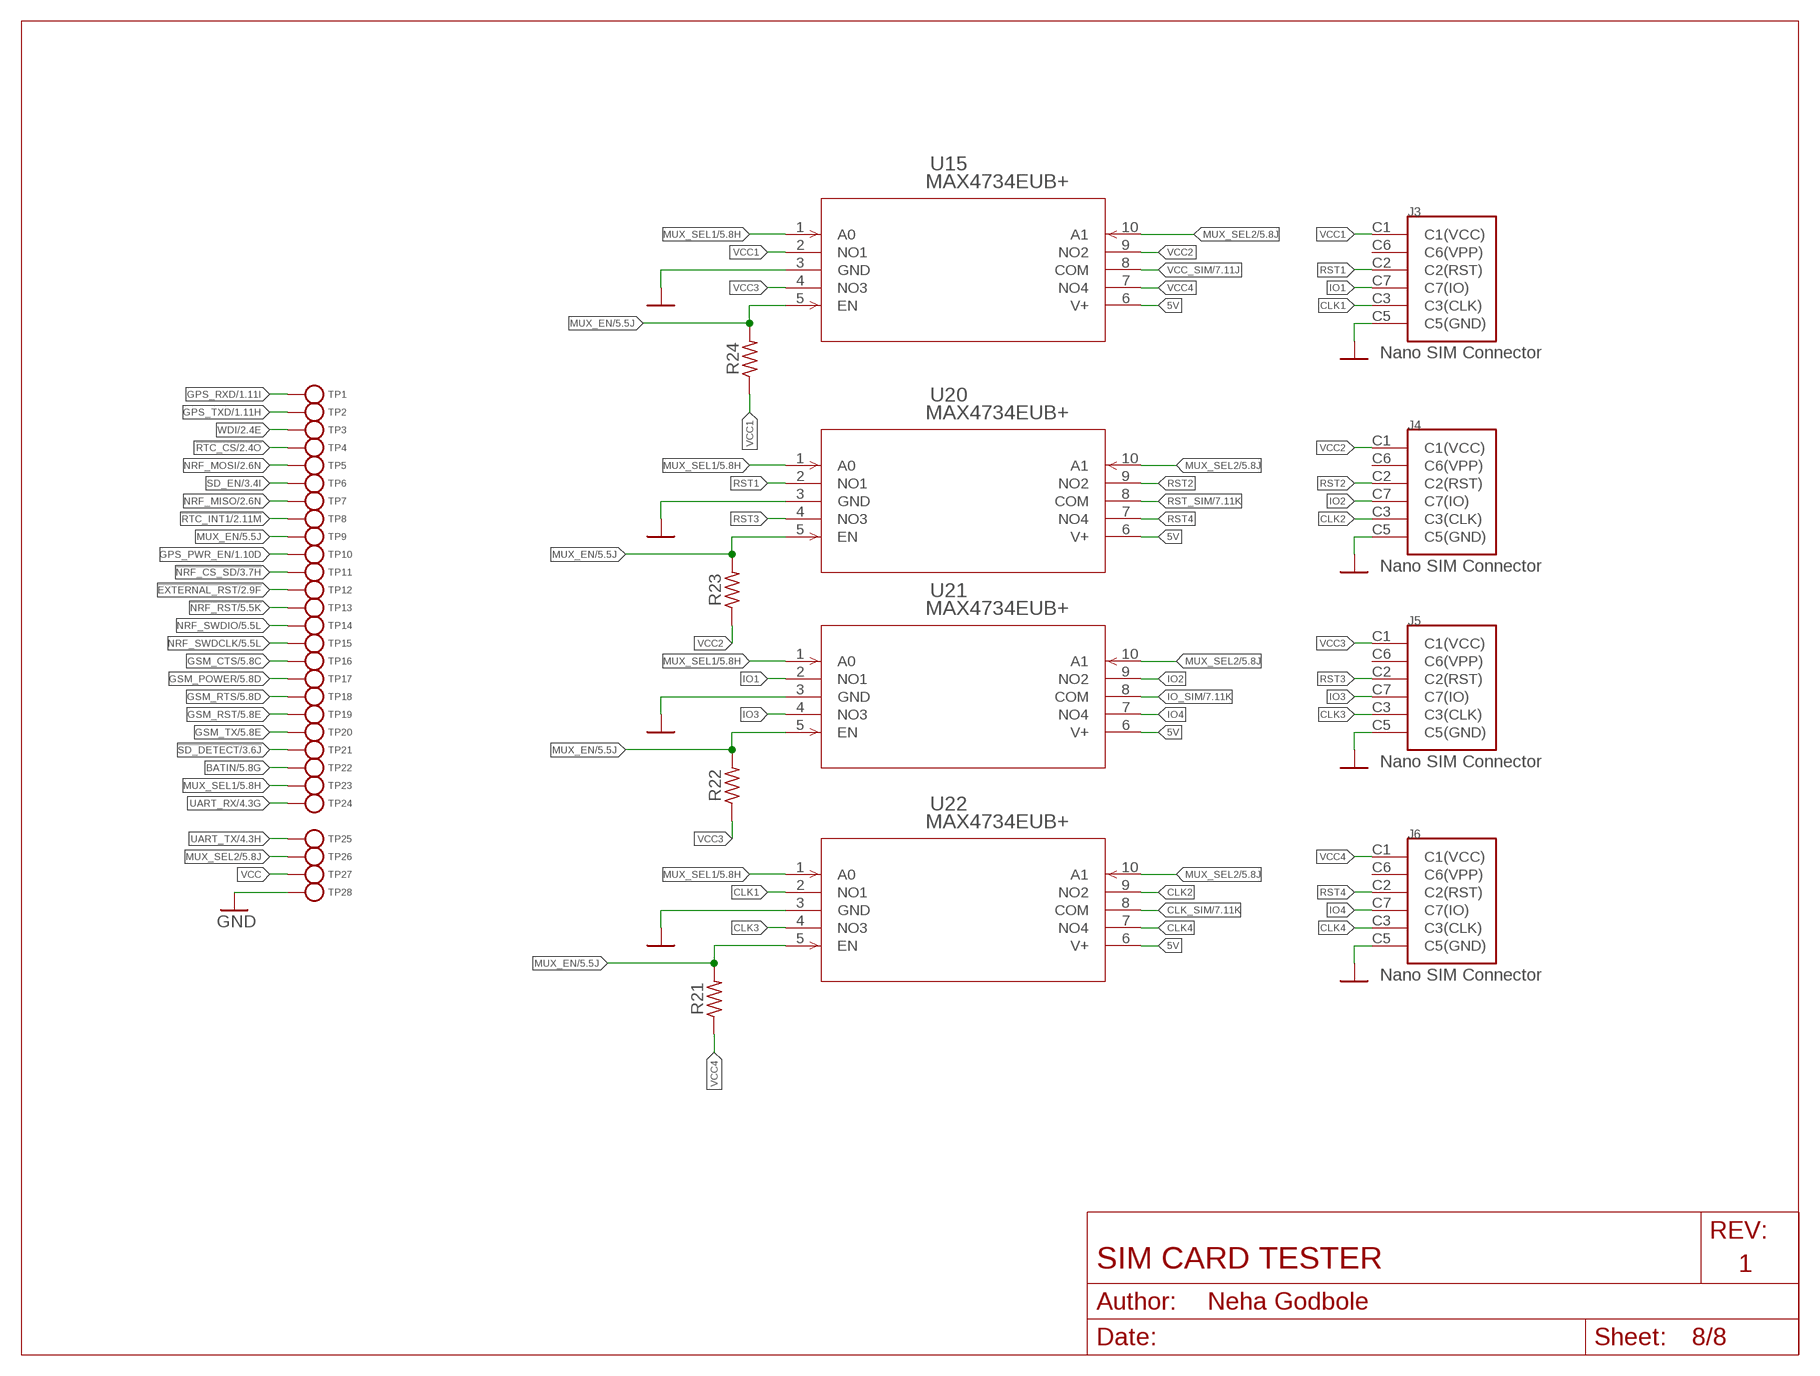
[diagram p7: schematic, sheet 8]
FRAME8 (LETTER_L_BLANK): AUTHOR: Neha Godbole; DATE: 4/22/19; REV: 1; TITLE: SIM CARD TESTER

### Parts
J3  NANO_SIM  [WURTH_NANO_SIM]
J4  NANO_SIM  [WURTH_NANO_SIM]
J5  NANO_SIM  [WURTH_NANO_SIM]
J6  NANO_SIM  [WURTH_NANO_SIM]
R21  10k  R-US_R0603  [R0603]
R22  10k  R-US_R0603  [R0603]
R23  10k  R-US_R0603  [R0603]
R24  10k  R-US_R0603  [R0603]
TP1  TEST-POINT  [PAD.03X.03]
TP2  TEST-POINT  [PAD.03X.03]
TP3  TEST-POINT  [PAD.03X.03]
TP4  TEST-POINT  [PAD.03X.03]
TP5  TEST-POINT  [PAD.03X.03]
TP6  TEST-POINT  [PAD.03X.03]
TP7  TEST-POINT  [PAD.03X.03]
TP8  TEST-POINT  [PAD.03X.03]
TP9  TEST-POINT  [PAD.03X.03]
TP10  TEST-POINT  [PAD.03X.03]
TP11  TEST-POINT  [PAD.03X.03]
TP12  TEST-POINT  [PAD.03X.03]
TP13  TEST-POINT  [PAD.03X.03]
TP14  TEST-POINT  [PAD.03X.03]
TP15  TEST-POINT  [PAD.03X.03]
TP16  TEST-POINT  [PAD.03X.03]
TP17  TEST-POINT  [PAD.03X.03]
TP18  TEST-POINT  [PAD.03X.03]
TP19  TEST-POINT  [PAD.03X.03]
TP20  TEST-POINT  [PAD.03X.03]
TP21  TEST-POINT  [PAD.03X.03]
TP22  TEST-POINT  [PAD.03X.03]
TP23  TEST-POINT  [PAD.03X.03]
TP24  TEST-POINT  [PAD.03X.03]
TP25  TEST-POINT  [PAD.03X.03]
TP26  TEST-POINT  [PAD.03X.03]
TP27  TEST-POINT  [PAD.03X.03]
TP28  TEST-POINT  [PAD.03X.03]
U15  MAX4734EUB+  [21-0061L]
U20  MAX4734EUB+  [21-0061L]
U21  MAX4734EUB+  [21-0061L]
U22  MAX4734EUB+  [21-0061L]

### Nets
5V: U15.6(V+) U20.6(V+) U21.6(V+) U22.6(V+) ; also sheet 2,4,6
!EXTERNAL_RST: TP12.P$1(TESTPOINT) ; also sheet 2,5
!NRF_CS_SD: TP11.P$1(TESTPOINT) ; also sheet 3,5
!NRF_RST: TP13.P$1(TESTPOINT) ; also sheet 5
!RTC_CS: TP4.P$1(TESTPOINT) ; also sheet 2,5
!RTC_INT1: TP8.P$1(TESTPOINT) ; also sheet 2,5
!SD_DETECT: TP21.P$1(TESTPOINT) ; also sheet 3,5
BATIN: TP22.P$1(TESTPOINT) ; also sheet 5,6
CLK1: J3.C3(C3(CLK)) U22.2(NO1)
CLK2: J4.C3(C3(CLK)) U22.9(NO2)
CLK3: J5.C3(C3(CLK)) U22.4(NO3)
CLK4: J6.C3(C3(CLK)) U22.7(NO4)
CLK_SIM: U22.8(COM) ; also sheet 7
GND: J3.C5(C5(GND)) J4.C5(C5(GND)) J5.C5(C5(GND)) J6.C5(C5(GND)) TP28.P$1(TESTPOINT) U15.3(GND) U20.3(GND) U21.3(GND) U22.3(GND) ; also sheet 1,2,3,4,5,6,7
GPS_PWR_EN: TP10.P$1(TESTPOINT) ; also sheet 1,5
GPS_RXD: TP1.P$1(TESTPOINT) ; also sheet 1,5
GPS_TXD: TP2.P$1(TESTPOINT) ; also sheet 1,5
GSM_CTS: TP16.P$1(TESTPOINT) ; also sheet 5,7
GSM_POWER: TP17.P$1(TESTPOINT) ; also sheet 5,7
GSM_RST: TP19.P$1(TESTPOINT) ; also sheet 5,7
GSM_RTS: TP18.P$1(TESTPOINT) ; also sheet 5,7
GSM_TX: TP20.P$1(TESTPOINT) ; also sheet 5,7
IO1: J3.C7(C7(IO)) U21.2(NO1)
IO2: J4.C7(C7(IO)) U21.9(NO2)
IO3: J5.C7(C7(IO)) U21.4(NO3)
IO4: J6.C7(C7(IO)) U21.7(NO4)
IO_SIM: U21.8(COM) ; also sheet 7
MUX_EN: R21.2 R22.2 R23.2 R24.2 TP9.P$1(TESTPOINT) U15.5(EN) U20.5(EN) U21.5(EN) U22.5(EN) ; also sheet 5
MUX_SEL1: TP23.P$1(TESTPOINT) U15.1(A0) U20.1(A0) U21.1(A0) U22.1(A0) ; also sheet 5
MUX_SEL2: TP26.P$1(TESTPOINT) U15.10(A1) U20.10(A1) U21.10(A1) U22.10(A1) ; also sheet 5
NRF_MISO: TP7.P$1(TESTPOINT) ; also sheet 2,3,5
NRF_MOSI: TP5.P$1(TESTPOINT) ; also sheet 2,3,5
NRF_SWDCLK: TP15.P$1(TESTPOINT) ; also sheet 5
NRF_SWDIO: TP14.P$1(TESTPOINT) ; also sheet 5
RST1: J3.C2(C2(RST)) U20.2(NO1)
RST2: J4.C2(C2(RST)) U20.9(NO2)
RST3: J5.C2(C2(RST)) U20.4(NO3)
RST4: J6.C2(C2(RST)) U20.7(NO4)
RST_SIM: U20.8(COM) ; also sheet 7
SD_EN: TP6.P$1(TESTPOINT) ; also sheet 3,5
UART_RX: TP24.P$1(TESTPOINT) ; also sheet 4,5
UART_TX: TP25.P$1(TESTPOINT) ; also sheet 4,5
VCC: TP27.P$1(TESTPOINT) ; also sheet 1,2,3,4,5,6,7
VCC1: J3.C1(C1(VCC)) R24.1 U15.2(NO1)
VCC2: J4.C1(C1(VCC)) R23.1 U15.9(NO2)
VCC3: J5.C1(C1(VCC)) R22.1 U15.4(NO3)
VCC4: J6.C1(C1(VCC)) R21.1 U15.7(NO4)
VCC_SIM: U15.8(COM) ; also sheet 7
WDI: TP3.P$1(TESTPOINT) ; also sheet 2,5
Unconnected: J3.C6(C6(VPP)) J4.C6(C6(VPP)) J5.C6(C6(VPP)) J6.C6(C6(VPP))

## Library data of the parts
A1 = antenna:GPS-ANTENNA; DESCRIPTION: PATCH ANT GPS/GLO CP SMD; DIGIKEY: 311-1531-ND; MANUFACTURER: Yageo; MPN: ANT1818B00BT1516S
B1 = batteries:MS518SE: A small, low leakage rechargeable battery for RTC backup; DIGIKEY: 728-1054-ND; MANUFACTURER: Seiko; MPN: MS518SE-FL35E
C1-C4 = Nordic_nRF:CAPACITOR: Generic chip capacitor; DIGIKEY: 311-1059-1-ND; MANUFACTURER: Yageo; MPN: CC0603JRNPO9BN120
C5 = Nordic_nRF:CAPACITOR: Generic chip capacitor; DIGIKEY: 399-7896-1-ND; MANUFACTURER: KEMET; MPN: C0603C330J1GACTU
C6 C32-C34 = Nordic_nRF:CAPACITOR: Generic chip capacitor; DIGIKEY: 399-3118-1-ND; MANUFACTURER: KEMET; MPN: C0603C105K8PACTU
C7-C12 = Nordic_nRF:CAPACITOR: Generic chip capacitor; DIGIKEY: 311-1065-1-ND; MANUFACTURER: Yageo; MPN: CC0603JRNPO9BN470
C13 = Nordic_nRF:CAPACITOR: Generic chip capacitor; DIGIKEY: 311-1066-1-ND; MANUFACTURER: Yageo; MPN: CC0603JRNPO9BN560
C14 = Nordic_nRF:CAPACITOR: Generic chip capacitor; DIGIKEY: 311-1069-1-ND; MANUFACTURER: Yageo; MPN: CC0603JRNPO9BN101
C15 = Nordic_nRF:CAPACITOR: Generic chip capacitor; DIGIKEY: 311-1189-1-ND; MANUFACTURER: Yageo; MPN: CC0603KRX7R9BB821
C16 = Nordic_nRF:CAPACITOR: Generic chip capacitor; DIGIKEY: 490-7194-1-ND; MANUFACTURER: Murata Electronics; MPN: GRM033R61E103KA12D; SPICEPREFIX: C
C17-C20 = Nordic_nRF:CAPACITOR: Generic chip capacitor; DIGIKEY: 490-7194-1-ND; MANUFACTURER: Murata Electronics; MPN: GRM033R61E103KA12D
C21 = Nordic_nRF:CAPACITOR: Generic chip capacitor; DIGIKEY: 490-5854-1-ND; MANUFACTURER: Murata Electronics; MPN: GCJ188R71H473KA12D
C22-C30 = Nordic_nRF:CAPACITOR: Generic chip capacitor; DIGIKEY: 490-5405-1-ND; MANUFACTURER: Murata Electronics; MPN: GRM033R61A104ME15D
C31 = Nordic_nRF:CAPACITOR: Generic chip capacitor; DIGIKEY: 399-3117-1-ND; MANUFACTURER: KEMET; MPN: C0603C824K8PACTU
C35 = Nordic_nRF:CAPACITOR: Generic chip capacitor; DIGIKEY: 490-12738-1-ND; MANUFACTURER: Murata Electronics; MPN: GRM188R61E225MA12D
C36-C41 = Nordic_nRF:CAPACITOR: Generic chip capacitor; DIGIKEY: 490-10992-1-ND; MANUFACTURER: Murata Electronics; MPN: ZRB18AR6YA475KE05L
C42-C45 = Nordic_nRF:CAPACITOR: Generic chip capacitor; DIGIKEY: 490-12538-1-ND; MANUFACTURER: Murata Electronics; MPN: GRM188R60J106KE47D
C46 = BeagleBone_Black_Wireless:C-US: CAPACITOR, American symbol; DIGIKEY: 490-9969-1-ND; MANUFACTURER: Murata Electronics; MPN: GRM32ER61A107ME20L
C47 = BeagleBone_Black_Wireless:C-US: CAPACITOR, American symbol; DIGIKEY: 490-16308-1-ND; MANUFACTURER: Murata Electronics; MPN: GRM32ER60J227ME05L
D1 = SparkFun-LED:LED: LED (Generic) Standard schematic elements and footprints for 5mm, 3mm, 1206, and 0603 sized LEDs. Generic LEDs with no color specified.
D2 = leds:SML-LX0404SIUPGUSB: 1mm^2 RGB LED; DIGIKEY: 67-2125-1-ND; MANUFACTURER: Lumex Opto; MPN: SML-LX0404SIUPGUSB
D3 D4 D6 D7 = passives:DIODE_ZENER; DIGIKEY: PESD0402-140CT-ND; MANUFACTURER: Littlefuse; MPN: PESD0402-140
D5 = leds:LED: LED; DESCRIPTION: LED BLUE CLEAR SMD; DIGIKEY: 160-1837-6-ND; MANUFACTURER: Lite-On Inc.; MPN: LTST-C194TBKT
FB1 = passives:FERRITE_BEAD; DIGIKEY: 240-2390-1-ND
IC1 = texas:TPS6300*: HIGH EFFICIENT SINGLE INDUCTOR BUCK-BOOST CONVERTER WITH 1.8-A SWITCHES Source: http://focus.ti.com/lit/ds/symlink/tps63001.pdf; MPN: TPS63000DRCTG4; OC_FARNELL: 1511852; OC_NEWARK: 59M7217
J1 = connector:CON_MICRO_SD: CONN MICRO SD R/A PUSH-PUSH SMD; DIGIKEY: HR1964CT-ND; MANUFACTOR: Hirose Electric Co Ltd; MPN: DM3AT-SF-PEJM5
J2 = connector:MICRO_USB_B_HIROSE_ZX62R-B-5P: USB Micro B Connector Rounded side is up.; DIGIKEY: H125274CT-ND
J3-J6 = signpost:NANO_SIM: WURTH Nano SIM Connector; DIGIKEY: 732-5954-1-ND
J7 = connector:TC2030-JLINK
J8 = connector:U.FL-R-SMT: U.FL-R-SMT Antenna Connector; DIGIKEY: H122041-ND; MANUFACTURER: Hirose; MPN: U.FL-R-SMT-1(01)
JP1 = SparkFun-Connectors:M02: Header 2 Standard 2-pin 0.1" header. Use with straight break away headers (SKU : PRT-00116), right angle break away headers (PRT-00553), swiss pins (PRT-00743), machine pins (PRT-00117), and female headers (PRT-00115). Molex polarized connector foot print use with SKU : PRT-08233 with associated crimp pins and housings.; DESCRIPTION: CONN HEADER PH TOP 2POS 2MM SMD; DIGIKEY: 455-1734-1-ND; MANUFACTURER: JST Sales America Inc.; MPN: B2B-PH-SM4-TB(LF)(SN)
L1 = Nordic_nRF:INDUCTOR: Generic chip inductor; DIGIKEY: 490-15723-1-ND; MANUFACTURER: Murata Electronics; MPN: LQW18AN5N6G8ZD
L2 = Nordic_nRF:INDUCTOR: Generic chip inductor; DIGIKEY: 490-15648-1-ND; MANUFACTURER: Murata Electronics; MPN: LQW18AN15NG8ZD
L3 = Nordic_nRF:INDUCTOR: Generic chip inductor; DIGIKEY: 490-14478-1-ND; MANUFACTURER: Murata Electronics; MPN: LQM18PN2R2MGHD
L4 = Nordic_nRF:INDUCTOR: Generic chip inductor; DIGIKEY: 587-1720-1-ND; MANUFACTURER: Taiyo Yuden; MPN: CBMF1608T100K
L5 L6 = Nordic_nRF:INDUCTOR: Generic chip inductor; DIGIKEY: 490-1015-1-ND; MANUFACTURER: BLM18AG102SN1D; MPN: Murata Electronics
LED1 = leds:LED: LED; DIGIKEY: 511-1578-1-ND; MANUFACTURER: Rohm; MPN: SML-D12M8WT86
Q1-Q3 = fets:MOSFET-NCHANNEL: Generic NMOS footprint; DESCRIPTION: MOSFET N-CH 60V 0.115A SOT-23; DIGIKEY: 2N7002LT1GOSCT-ND; MANUFACTURER: ON Semiconductor; MPN: 2N7002LT1G
Q4 = fets:SI223DDS: 6A SOT-23 P Fet; DIGIKEY: SI2333DDS-T1-GE3CT-ND; MANUFACTURER: Vishay Siliconix; MPN: SI2333DDS-T1-GE3
R1 R2 = BeagleBone_Black_Wireless:R-US_: RESISTOR, American symbol; DIGIKEY: 311-27GRCT-ND; MANUFACTURER: Yageo; MPN: RC0603JR-0727RL
R3-R6 = BeagleBone_Black_Wireless:R-US_: RESISTOR, American symbol; DIGIKEY: 311-100HRCT-ND; MANUFACTURER: Yageo; MPN: RC0603FR-07100RL
R7-R9 = BeagleBone_Black_Wireless:R-US_: RESISTOR, American symbol; DIGIKEY: 311-470HRCT-ND; MANUFACTURER: Yageo; MPN: RC0603FR-07470RL
R10-R12 = BeagleBone_Black_Wireless:R-US_: RESISTOR, American symbol; DIGIKEY: 311-1.0KGRCT-ND; MANUFACTURER: Yageo; MPN: RC0603JR-071KL
R13 = BeagleBone_Black_Wireless:R-US_: RESISTOR, American symbol; DIGIKEY: 311-2.00KHRCT-ND; MANUFACTURER: Yageo; MPN: RC0603FR-072KL
R14-R25 = BeagleBone_Black_Wireless:R-US_: RESISTOR, American symbol; DIGIKEY: 311-10KGRCT-ND; MANUFACTURER: Yageo; MPN: RC0603JR-0710KL
R26-R31 = BeagleBone_Black_Wireless:R-US_: RESISTOR, American symbol; DIGIKEY: 311-100KGRCT-ND; MANUFACTURER: Yageo; MPN: RC0603JR-07100KL
R32 = BeagleBone_Black_Wireless:R-US_: RESISTOR, American symbol; DIGIKEY: 311-200KGRTR-ND; MANUFACTURER: Yageo; MPN: RC0603JR-07200KL
R33 = BeagleBone_Black_Wireless:R-US_: RESISTOR, American symbol; DIGIKEY: 311-499KHRCT-ND; MANUFACTURER: Yageo; MPN: RC0603FR-07499KL
R34 = BeagleBone_Black_Wireless:R-US_: RESISTOR, American symbol; DIGIKEY: 311-825KHRCT-ND; MANUFACTURER: Yageo; MPN: RC0603FR-07825KL
R35 = BeagleBone_Black_Wireless:R-US_: RESISTOR, American symbol; DIGIKEY: 311-1.00MHRCT-ND; MANUFACTURER: Yageo; MPN: RC0603FR-071ML
R36 = BeagleBone_Black_Wireless:R-US_: RESISTOR, American symbol; DIGIKEY: YAG3326CT-ND; MANUFACTURER: Yageo; MPN: RC0603FR-071M3L
R37 = BeagleBone_Black_Wireless:R-US_: RESISTOR, American symbol; DIGIKEY: 311-2.2MGRCT-ND; MANUFACTURER: Yageo; MPN: RC0603JR-072M2L
R38 = BeagleBone_Black_Wireless:R-US_: RESISTOR, American symbol; DIGIKEY: 311-10MGRCT-ND; MANUFACTURER: Yageo; MPN: RC0603JR-0710ML
TP1-TP30 = headers:TEST-POINT
TP31 = testpad:TP: Test pad
U1 = chips:AB1815-T3: Ultra-low current RTC. 55nA quiescent @ 3V. 1.5-3.6V input.; DIGIKEY: 535-11936-1-ND; MANUFACTURER: Abracon; MPN: AB1815-T3
U2 = Particle:BGA725L6; DESCRIPTION: IC AMP MMIC RF LNA 20DB TSLP-6; DIGIKEY: BGA725L6E6327FTSA1CT-ND; MANUFACTURER: Infineon; MPN: BGA725L6E6327FTSA1
U3 = chips:FTDI234XD: FTDI234XD USB to UART Bridge in 3x3 DFN Package; DIGIKEY: 768-1178-1-ND; MOUSER: 895-FT234XD-R; NEWARK: 53X3171
U4 = Particle:FILTERS; DESCRIPTION: FILTER SAW 1.582GHZ 5SMD; DIGIKEY: 587-3990-1-ND; MANUFACTURER: Taiyo Yuden; MPN: F6QA1G582H2JM-J
U5 = chips:MAX8887: IC REG LDO 3.3V 0.3A TSOT23-5; DIGIKEY: MAX8887EZK33+TCT-ND
U6 = chips:MCP73831: Description: Device for MCP73831 <https://www.microchip.com/wwwproducts/en/MCP73831>, a battery charge controller from Microchip.; DATASHEET: http://ww1.microchip.com/downloads/en/DeviceDoc/20001984g.pdf; DESCRIPTION: IC CONTROLLER LI-ION 4.2V 8DFN; DIGIKEY: MCP73831T-2ACI/MCCT-ND; MANUFACTURER: Microchip Technology; MOUSER: 579-MCP73832T-2ACIMC; MPN: MCP73831T-2ACI/MC
U7 = u-blox:MAX-M8; DESCRIPTION: IC RECEIVER GPS/GNSS 18LCC; DIGIKEY: 672-1003-1-ND; MANUFACTURER: u-blox; MPN: MAX-M8Q-0
U8 = chips:MAX67XX: A simple watchdog timer with adjustable timeouts and reset time; DIGIKEY: MAX6749KA+TCT-ND; MANUFACTURER: Maxim Integrated; MPN: MAX6749KA+T
U9 = chips:NRF52840: ultra-low power 2.4 GHz wireless system on chip (SoC) integrating a multiprotocol 2.4 GHz transceiver, an ARM® Cortex®-M4F CPU.; DIGIKEY: 1490-1071-1-ND; MANUFACTURER: NORIDIC SEMICONDUCTOR; MPN: NRF52840
U10 U11 = chips:SIP32510: Load switch, slew rate controlled. By Vishay; DIGIKEY: SIP32510DT-T1-GE3CT-ND; MANUFACTURER: Vishay; MPN: SIP32510DT-T1-GE3
U12 = signpost:UBLOX_SARA_G350: Sara G350 2.5G Radio Module
U13 = chips:TXB0104RUT: 4-channel bidirectional level translater; DIGIKEY: 296-25888-1-ND; MANUFACTURER: TI; MPN: TXB0104RUTR
U15 U20-U22 = max4734_mux:MAX4734EUB+; MANUFACTURER_PART_NUMBER: MAX4734EUB+; VENDOR: Maxim Integrated Products
X1 = crystals:ABS07-32.768KHZ: 32.768kHz Crystal; DIGIKEY: 535-9543-1-ND; MANUFACTURER: ABRACON; MPN: ABS07-32.768KHZ-7-T
X4 = crystals:7V: TXC CRYSTAL SMD; DIGIKEY: 887-2568-1-ND; MANUFACTURER: TXC CORPORATION; MPN: 7M-32.000MAHV-T
X5 = crystals:ABS05-32.768KHZ: 32.768kHz Crystal; DIGIKEY: 535-11897-1-ND; MANUFACTURER: Abracon; MPN: ABS05-32.768KHZ-9-T